# EAGLE design calculator_v0_0 (EAGLE 5.12)

## Sheet 1 of 6
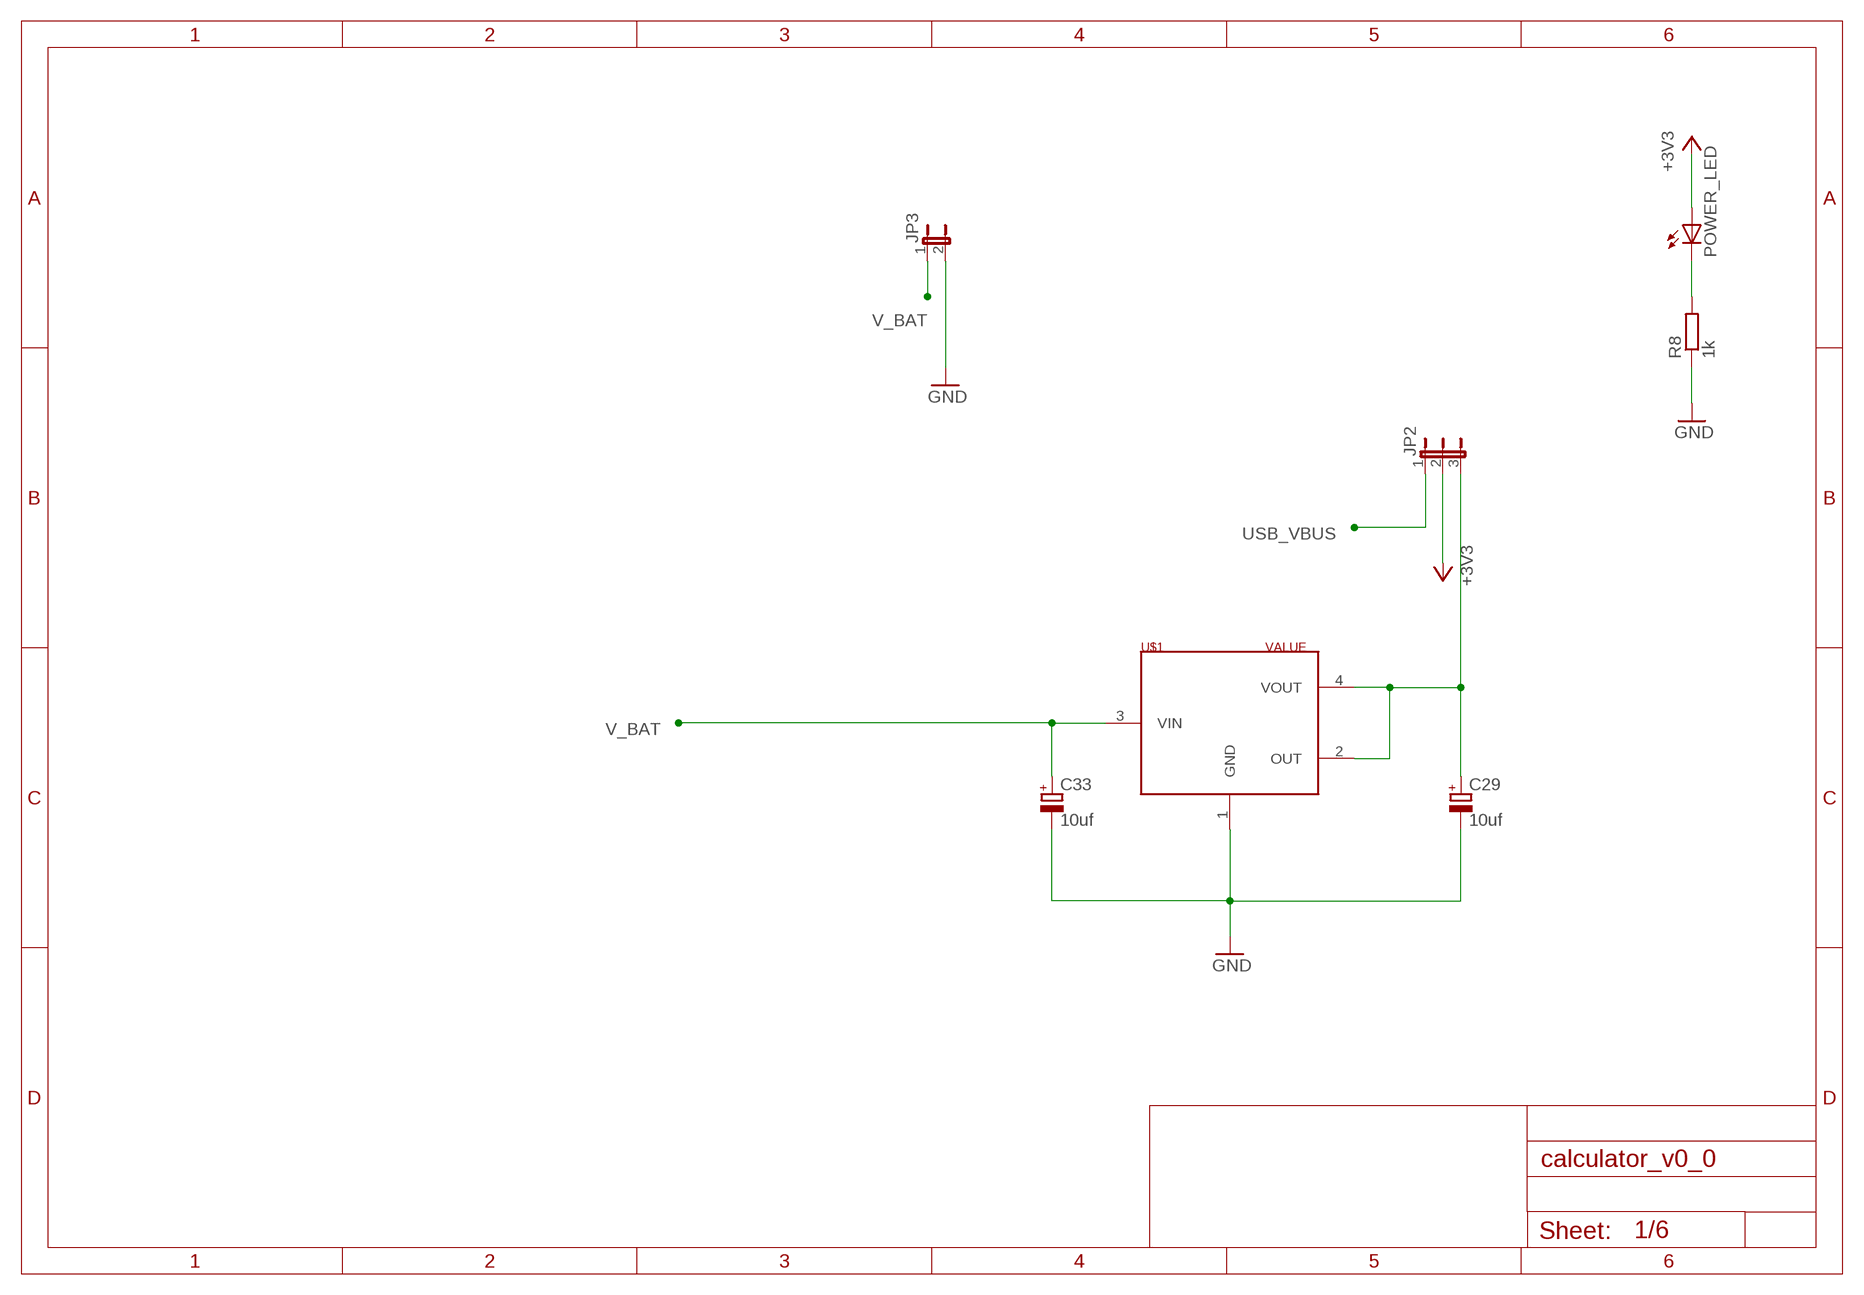
[diagram p0: schematic, sheet 1]

### Parts
C29  10uf  CPOL-EUSMCA  [SMC_A]
C33  10uf  CPOL-EUSMCD  [SMC_D]
JP2  JP2E  [JP2]
JP3  JP1E  [JP1]
POWER_LED  LED3MM  [LED3MM]
R8  1k  R-EU_R0603  [R0603]
U$1  LM1117MPX-5V  [SOT223]

### Nets
+3V3: JP2.2 POWER_LED.A ; also sheet 2,6
GND: C29.- C33.- JP3.2 R8.1 U$1.1(GND) ; also sheet 2,6
N$5: POWER_LED.K(C) R8.2
N$9: C29.+ JP2.3 U$1.2(OUT) U$1.4(VOUT)
USB_VBUS: JP2.1 ; also sheet 2
V_BAT: C33.+ JP3.1 U$1.3(VIN)

## Sheet 2 of 6
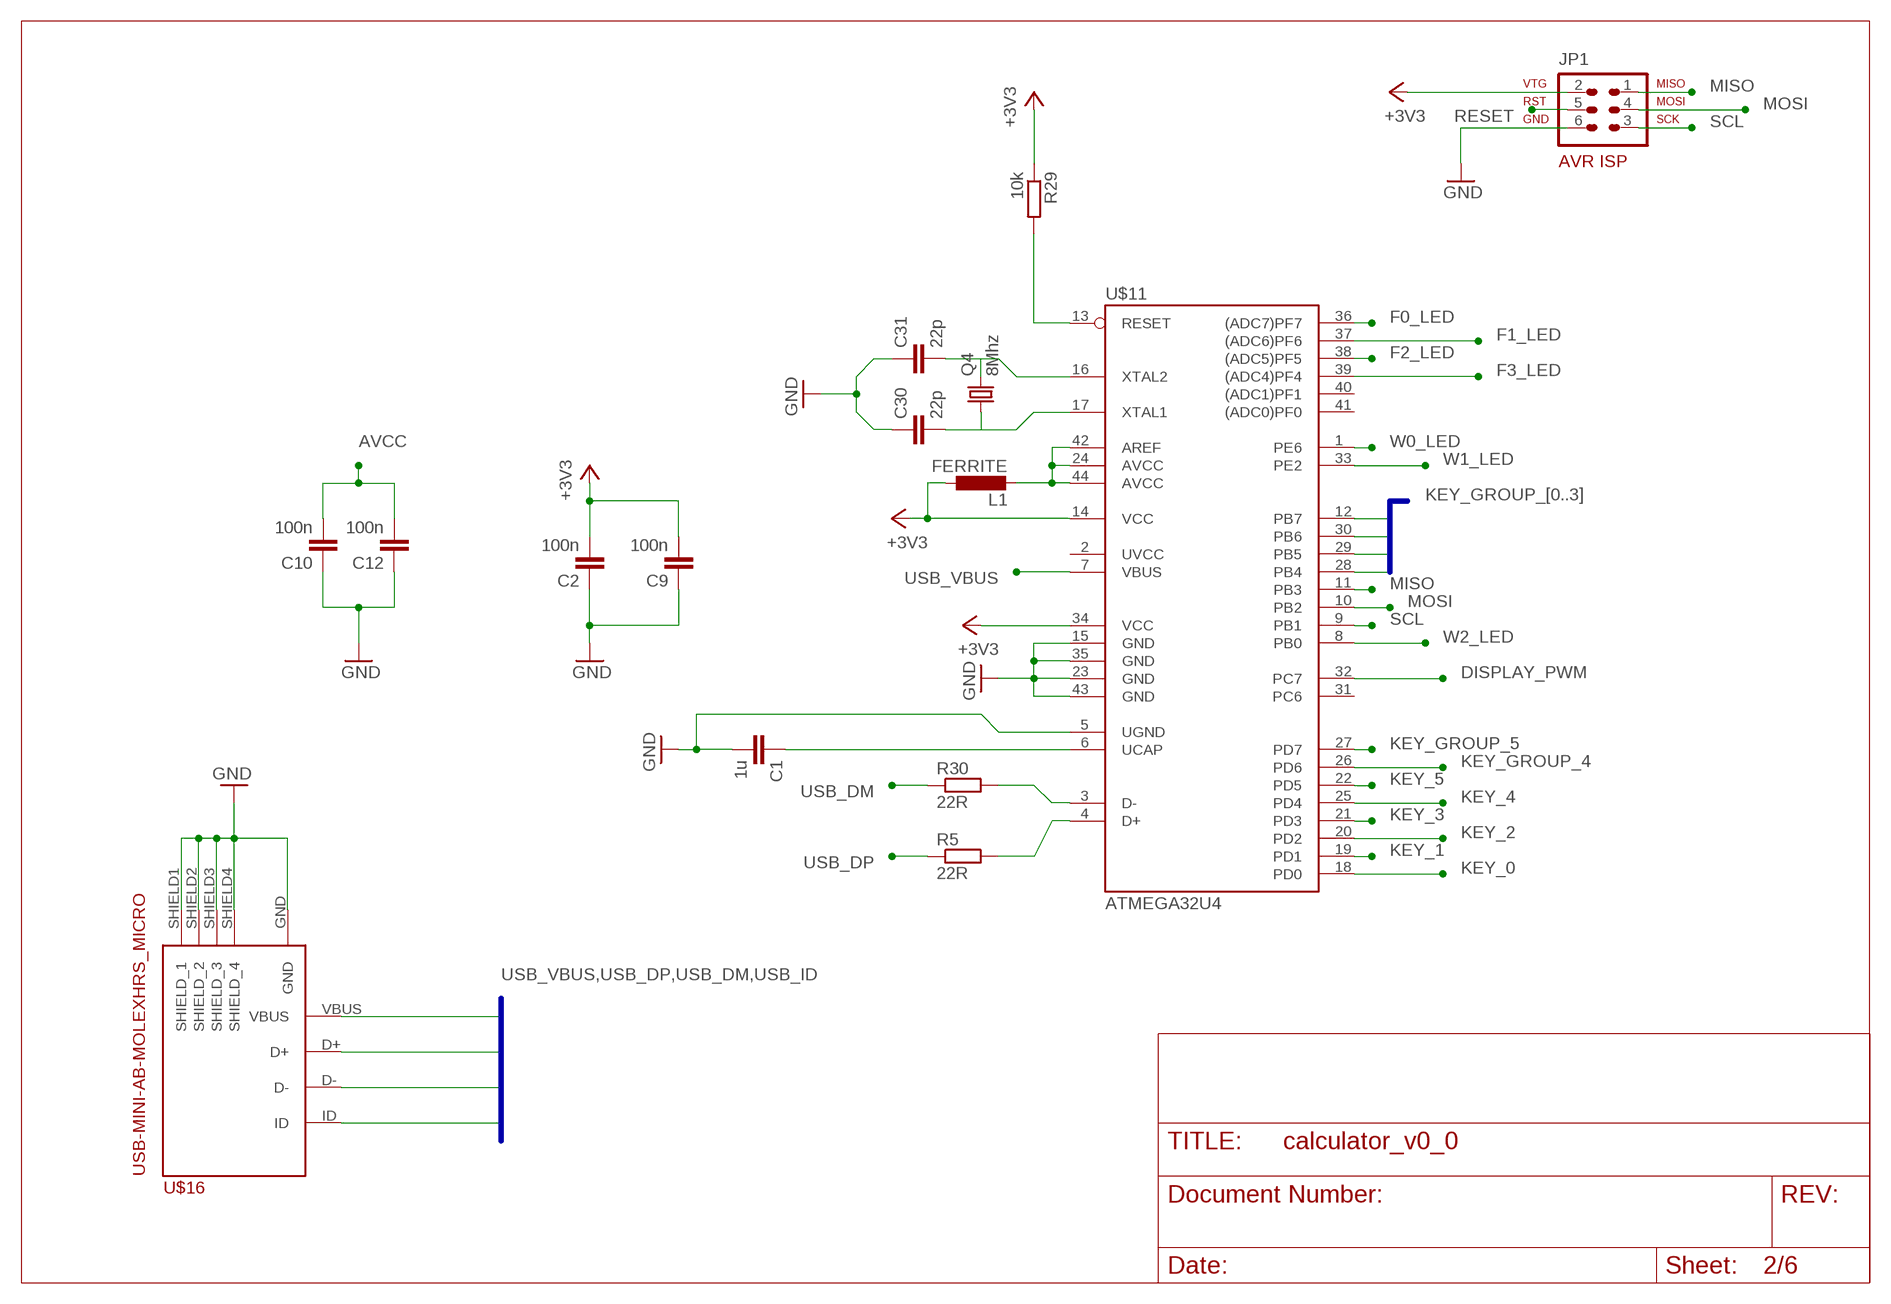
[diagram p1: schematic, sheet 2]

### Parts
C1  1u  C-EUC0603  [C0603]
C2  100n  C-EUC0603  [C0603]
C9  100n  C-EUC0603  [C0603]
C10  100n  C-EUC0603  [C0603]
C12  100n  C-EUC0603  [C0603]
C30  22p  C-EUC0603K  [C0603K]
C31  22p  C-EUC0603K  [C0603K]
JP1  AVR-ISP-6  [AVR-ISP-6]
L1  FERRITE  L-EU603  [R0603]
Q4  8Mhz  CRYSTAL3225  [3225]
R5  22R  R-EU_R0603  [R0603]
R29  10k  R-EU_R0603  [R0603]
R30  22R  R-EU_R0603  [R0603]
U$11  ATMEGA32U4  [TQFP44]
U$16  USB-MINI-AB-MOLEXHRS_MICRO  [ZX62-B-5PA]

### Nets
+3V3: C2.2 C9.2 JP1.2 L1.1 R29.1 U$11.14(VCC) U$11.34(VCC) ; also sheet 1,6
AVCC: C10.2 C12.2 L1.2 U$11.24(AVCC) U$11.42(AREF) U$11.44(AVCC)
DISPLAY_PWM: U$11.32(PC7) ; also sheet 6
F0_LED: U$11.36((ADC7)PF7) ; also sheet 6
F1_LED: U$11.37((ADC6)PF6) ; also sheet 6
F2_LED: U$11.38((ADC5)PF5) ; also sheet 6
F3_LED: U$11.39((ADC4)PF4) ; also sheet 6
GND: C1.2 C2.1 C9.1 C10.1 C12.1 C30.1 C31.1 JP1.6 U$11.5(UGND) U$11.15(GND) U$11.23(GND) U$11.35(GND) U$11.43(GND) U$16.GND U$16.SHIELD1(SHIELD_1) U$16.SHIELD2(SHIELD_2) U$16.SHIELD3(SHIELD_3) U$16.SHIELD4(SHIELD_4) ; also sheet 1,6
KEY_0: U$11.18(PD0) ; also sheet 3
KEY_1: U$11.19(PD1) ; also sheet 3
KEY_2: U$11.20(PD2) ; also sheet 4
KEY_3: U$11.21(PD3) ; also sheet 4
KEY_4: U$11.25(PD4) ; also sheet 5
KEY_5: U$11.22(PD5) ; also sheet 5
KEY_GROUP_0: U$11.28(PB4) ; also sheet 3,4,5
KEY_GROUP_1: U$11.29(PB5) ; also sheet 3,4,5
KEY_GROUP_2: U$11.30(PB6) ; also sheet 3,4,5
KEY_GROUP_3: U$11.12(PB7) ; also sheet 3,4,5
KEY_GROUP_4: U$11.26(PD6) ; also sheet 3,4,5
KEY_GROUP_5: U$11.27(PD7) ; also sheet 3,4,5
MISO: JP1.1 U$11.11(PB3) ; also sheet 6
MOSI: JP1.4 U$11.10(PB2) ; also sheet 6
N$1: C30.2 Q4.1 U$11.17(XTAL1)
N$2: R5.2 U$11.4(D+)
N$3: C1.1 U$11.6(UCAP)
N$20: R30.2 U$11.3(D-)
N$29: C31.2 Q4.3 U$11.16(XTAL2)
RESET: JP1.5 R29.2 U$11.13(RESET)
SCL: JP1.3 U$11.9(PB1) ; also sheet 6
USB_DM: R30.1 U$16.D-
USB_DP: R5.1 U$16.D+
USB_ID: U$16.ID
USB_VBUS: U$11.7(VBUS) U$16.VBUS ; also sheet 1
W0_LED: U$11.1(PE6) ; also sheet 6
W1_LED: U$11.33(PE2) ; also sheet 6
W2_LED: U$11.8(PB0) ; also sheet 6
Unconnected: U$11.31(PC6) U$11.40((ADC1)PF1) U$11.41((ADC0)PF0)

### Buses
USB_VBUS,USB_DP,USB_DM,USB_ID
KEY_GROUP_[0..3]

## Sheet 3 of 6
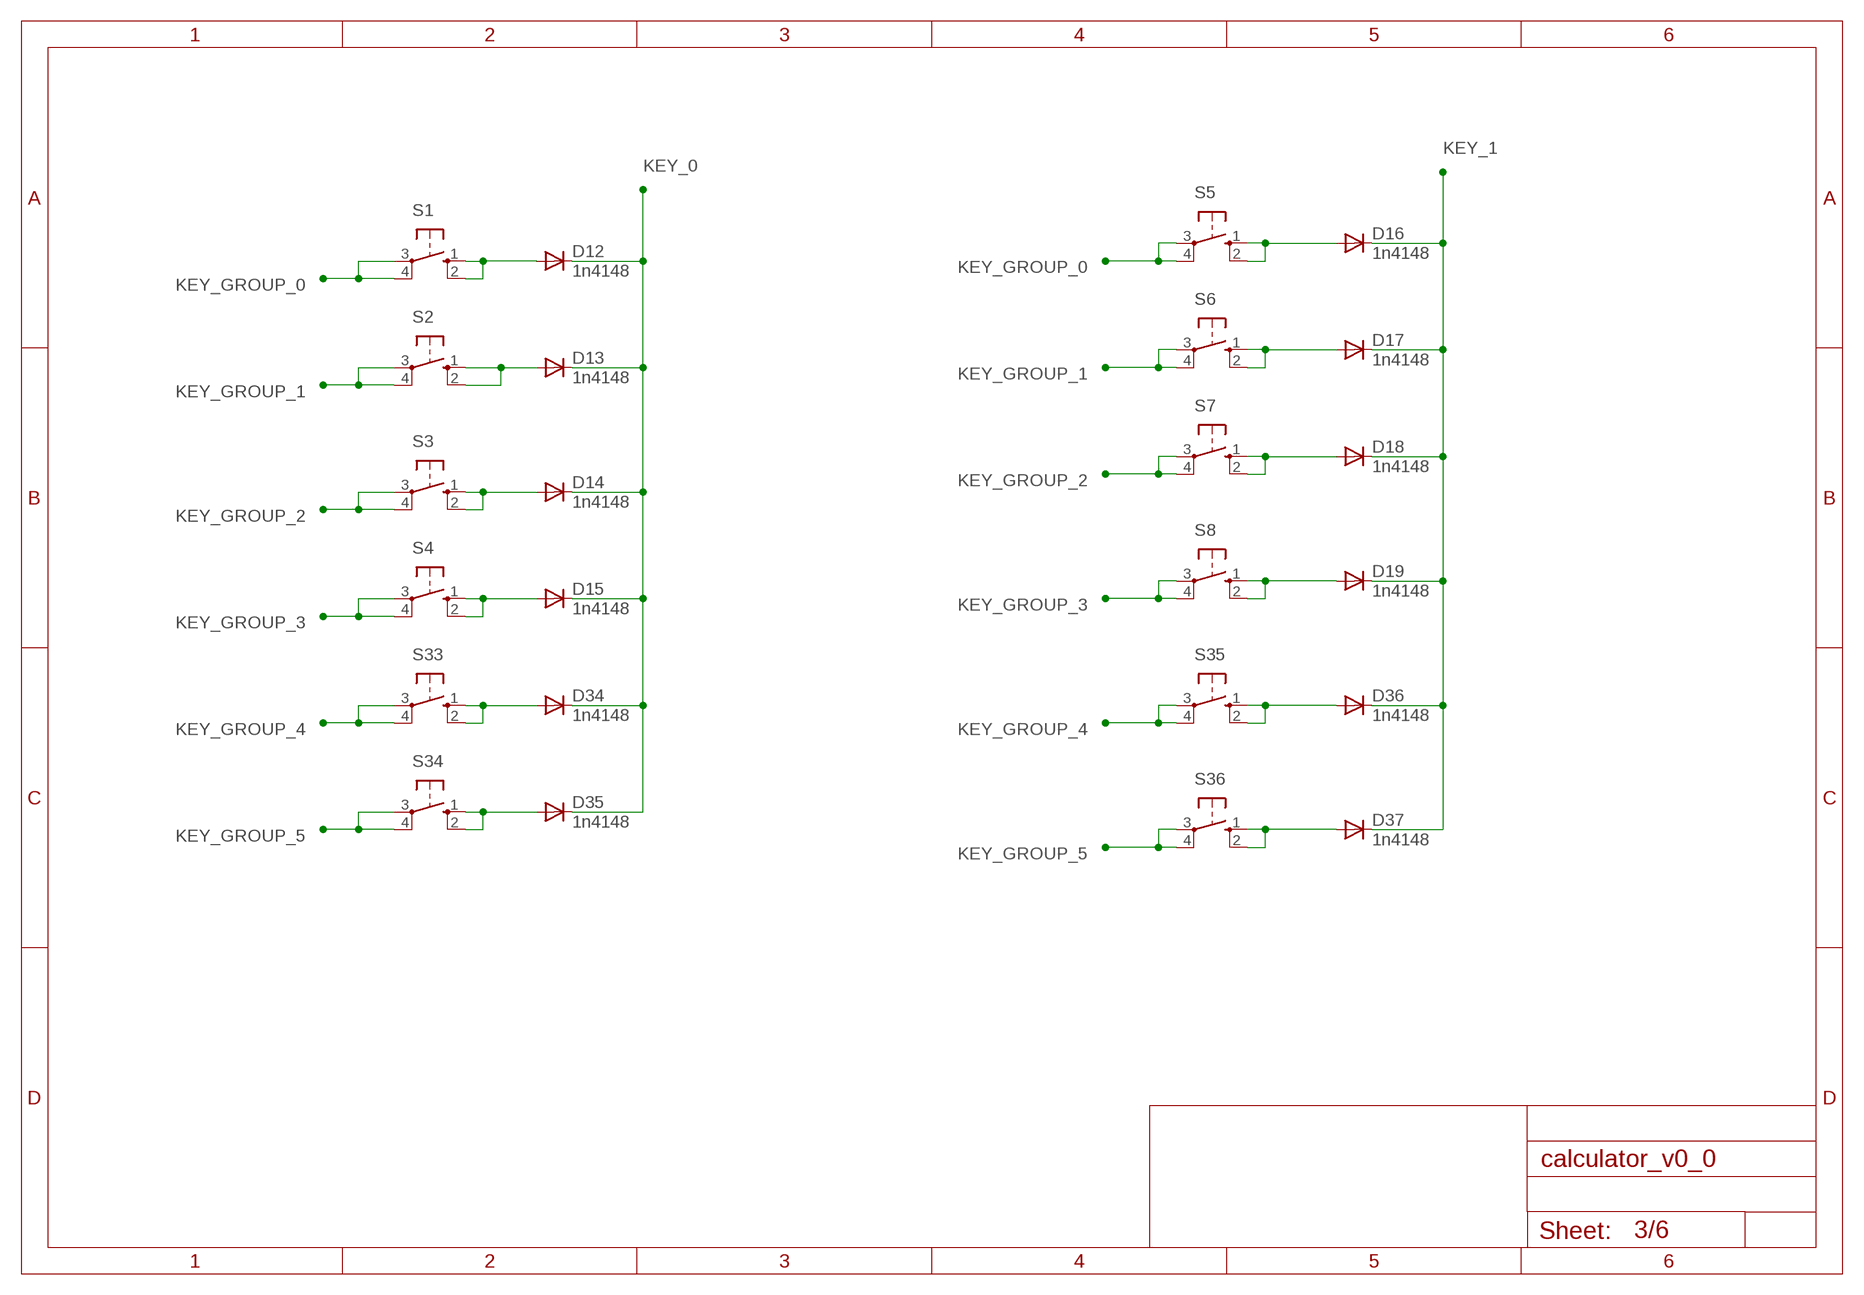
[diagram p2: schematic, sheet 3]

### Parts
D12  1n4148  DIODE-MINIMELF  [MINIMELF]
D13  1n4148  DIODE-MINIMELF  [MINIMELF]
D14  1n4148  DIODE-MINIMELF  [MINIMELF]
D15  1n4148  DIODE-MINIMELF  [MINIMELF]
D16  1n4148  DIODE-MINIMELF  [MINIMELF]
D17  1n4148  DIODE-MINIMELF  [MINIMELF]
D18  1n4148  DIODE-MINIMELF  [MINIMELF]
D19  1n4148  DIODE-MINIMELF  [MINIMELF]
D34  1n4148  DIODE-MINIMELF  [MINIMELF]
D35  1n4148  DIODE-MINIMELF  [MINIMELF]
D36  1n4148  DIODE-MINIMELF  [MINIMELF]
D37  1n4148  DIODE-MINIMELF  [MINIMELF]
S1  40-XX  [B3F-40XX]
S2  40-XX  [B3F-40XX]
S3  40-XX  [B3F-40XX]
S4  40-XX  [B3F-40XX]
S5  40-XX  [B3F-40XX]
S6  40-XX  [B3F-40XX]
S7  40-XX  [B3F-40XX]
S8  40-XX  [B3F-40XX]
S33  40-XX  [B3F-40XX]
S34  40-XX  [B3F-40XX]
S35  40-XX  [B3F-40XX]
S36  40-XX  [B3F-40XX]

### Nets
KEY_0: D12.C D13.C D14.C D15.C D34.C D35.C ; also sheet 2
KEY_1: D16.C D17.C D18.C D19.C D36.C D37.C ; also sheet 2
KEY_GROUP_0: S1.3(P) S1.4(P1) S5.3(P) S5.4(P1) ; also sheet 2,4,5
KEY_GROUP_1: S2.3(P) S2.4(P1) S6.3(P) S6.4(P1) ; also sheet 2,4,5
KEY_GROUP_2: S3.3(P) S3.4(P1) S7.3(P) S7.4(P1) ; also sheet 2,4,5
KEY_GROUP_3: S4.3(P) S4.4(P1) S8.3(P) S8.4(P1) ; also sheet 2,4,5
KEY_GROUP_4: S33.3(P) S33.4(P1) S35.3(P) S35.4(P1) ; also sheet 2,4,5
KEY_GROUP_5: S34.3(P) S34.4(P1) S36.3(P) S36.4(P1) ; also sheet 2,4,5
N$16: D34.A S33.1(S) S33.2(S1)
N$17: D35.A S34.1(S) S34.2(S1)
N$19: D36.A S35.1(S) S35.2(S1)
N$21: D37.A S36.1(S) S36.2(S1)
N$76: D14.A S3.1(S) S3.2(S1)
N$77: D15.A S4.1(S) S4.2(S1)
N$78: D13.A S2.1(S) S2.2(S1)
N$80: D12.A S1.1(S) S1.2(S1)
N$81: D19.A S8.1(S) S8.2(S1)
N$83: D17.A S6.1(S) S6.2(S1)
N$84: D16.A S5.1(S) S5.2(S1)
N$87: D18.A S7.1(S) S7.2(S1)

## Sheet 4 of 6
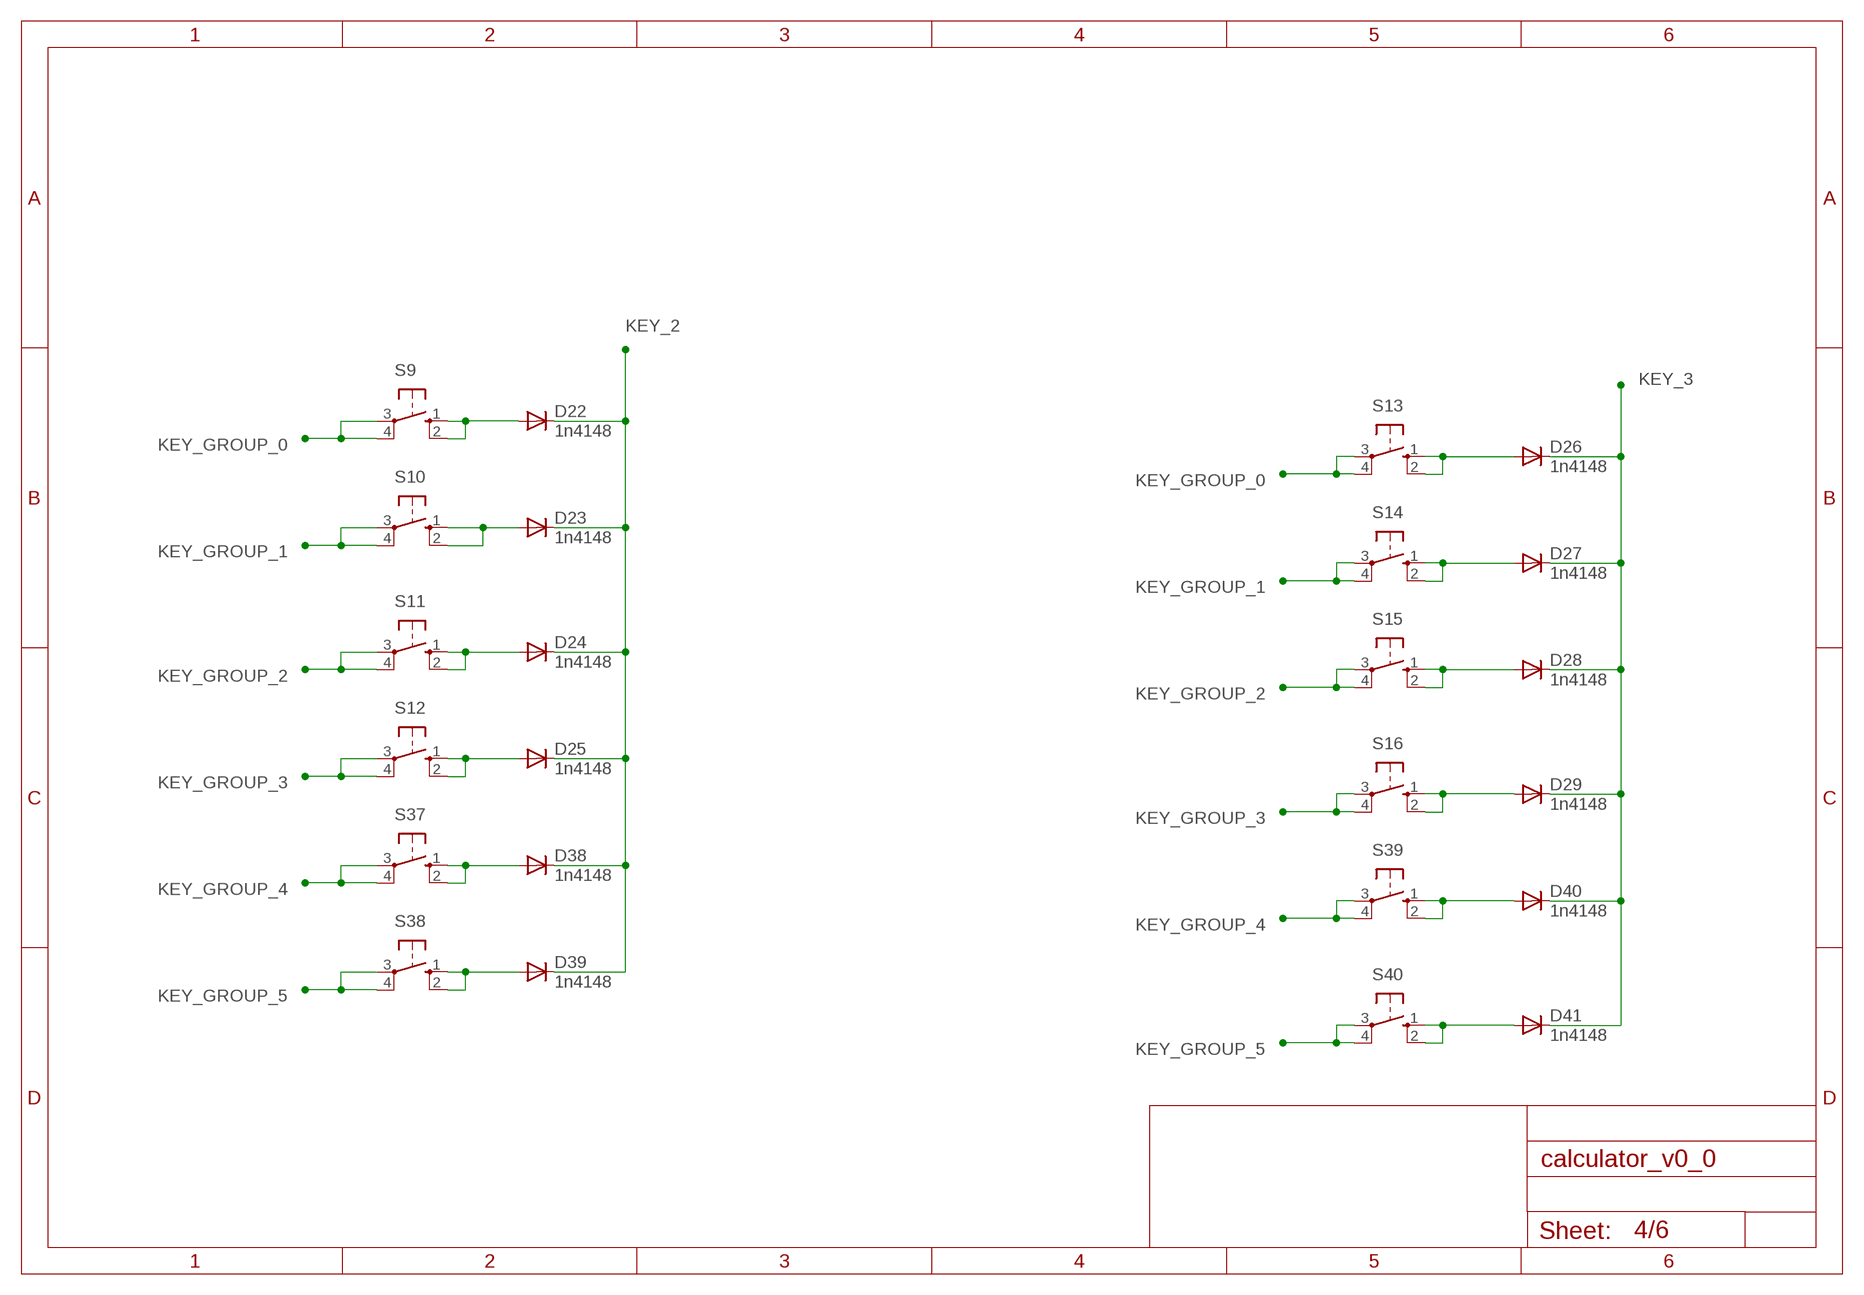
[diagram p3: schematic, sheet 4]

### Parts
D22  1n4148  DIODE-MINIMELF  [MINIMELF]
D23  1n4148  DIODE-MINIMELF  [MINIMELF]
D24  1n4148  DIODE-MINIMELF  [MINIMELF]
D25  1n4148  DIODE-MINIMELF  [MINIMELF]
D26  1n4148  DIODE-MINIMELF  [MINIMELF]
D27  1n4148  DIODE-MINIMELF  [MINIMELF]
D28  1n4148  DIODE-MINIMELF  [MINIMELF]
D29  1n4148  DIODE-MINIMELF  [MINIMELF]
D38  1n4148  DIODE-MINIMELF  [MINIMELF]
D39  1n4148  DIODE-MINIMELF  [MINIMELF]
D40  1n4148  DIODE-MINIMELF  [MINIMELF]
D41  1n4148  DIODE-MINIMELF  [MINIMELF]
S9  40-XX  [B3F-40XX]
S10  40-XX  [B3F-40XX]
S11  40-XX  [B3F-40XX]
S12  40-XX  [B3F-40XX]
S13  40-XX  [B3F-40XX]
S14  40-XX  [B3F-40XX]
S15  40-XX  [B3F-40XX]
S16  40-XX  [B3F-40XX]
S37  40-XX  [B3F-40XX]
S38  40-XX  [B3F-40XX]
S39  40-XX  [B3F-40XX]
S40  40-XX  [B3F-40XX]

### Nets
KEY_2: D22.C D23.C D24.C D25.C D38.C D39.C ; also sheet 2
KEY_3: D26.C D27.C D28.C D29.C D40.C D41.C ; also sheet 2
KEY_GROUP_0: S9.3(P) S9.4(P1) S13.3(P) S13.4(P1) ; also sheet 2,3,5
KEY_GROUP_1: S10.3(P) S10.4(P1) S14.3(P) S14.4(P1) ; also sheet 2,3,5
KEY_GROUP_2: S11.3(P) S11.4(P1) S15.3(P) S15.4(P1) ; also sheet 2,3,5
KEY_GROUP_3: S12.3(P) S12.4(P1) S16.3(P) S16.4(P1) ; also sheet 2,3,5
KEY_GROUP_4: S37.3(P) S37.4(P1) S39.3(P) S39.4(P1) ; also sheet 2,3,5
KEY_GROUP_5: S38.3(P) S38.4(P1) S40.3(P) S40.4(P1) ; also sheet 2,3,5
N$27: D38.A S37.1(S) S37.2(S1)
N$28: D39.A S38.1(S) S38.2(S1)
N$39: D40.A S39.1(S) S39.2(S1)
N$41: D41.A S40.1(S) S40.2(S1)
N$93: D24.A S11.1(S) S11.2(S1)
N$95: D25.A S12.1(S) S12.2(S1)
N$96: D23.A S10.1(S) S10.2(S1)
N$97: D22.A S9.1(S) S9.2(S1)
N$99: D29.A S16.1(S) S16.2(S1)
N$101: D28.A S15.1(S) S15.2(S1)
N$102: D27.A S14.1(S) S14.2(S1)
N$104: D26.A S13.1(S) S13.2(S1)

## Sheet 5 of 6
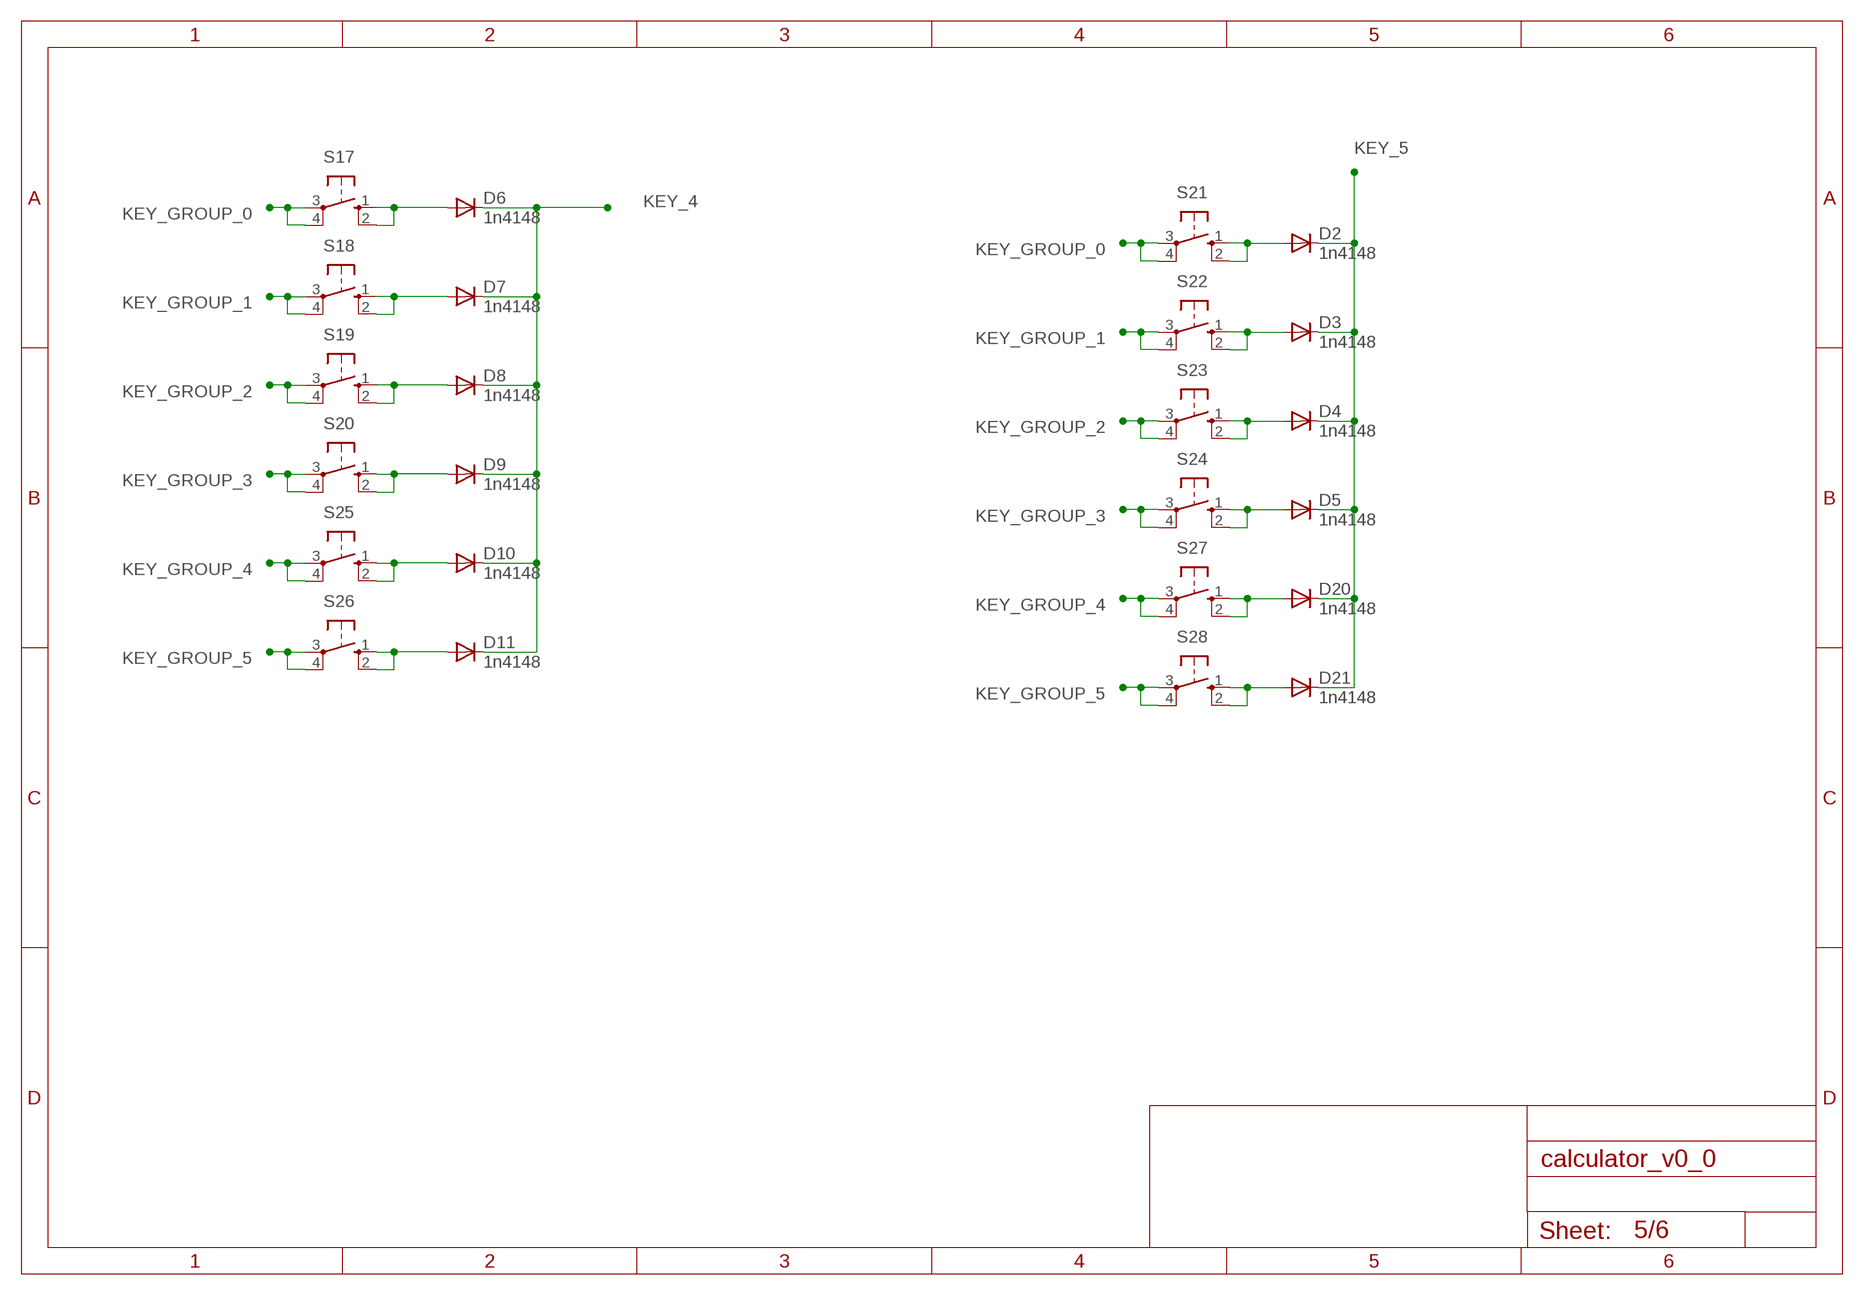
[diagram p4: schematic, sheet 5]

### Parts
D2  1n4148  DIODE-MINIMELF  [MINIMELF]
D3  1n4148  DIODE-MINIMELF  [MINIMELF]
D4  1n4148  DIODE-MINIMELF  [MINIMELF]
D5  1n4148  DIODE-MINIMELF  [MINIMELF]
D6  1n4148  DIODE-MINIMELF  [MINIMELF]
D7  1n4148  DIODE-MINIMELF  [MINIMELF]
D8  1n4148  DIODE-MINIMELF  [MINIMELF]
D9  1n4148  DIODE-MINIMELF  [MINIMELF]
D10  1n4148  DIODE-MINIMELF  [MINIMELF]
D11  1n4148  DIODE-MINIMELF  [MINIMELF]
D20  1n4148  DIODE-MINIMELF  [MINIMELF]
D21  1n4148  DIODE-MINIMELF  [MINIMELF]
S17  40-XX  [B3F-40XX]
S18  40-XX  [B3F-40XX]
S19  40-XX  [B3F-40XX]
S20  40-XX  [B3F-40XX]
S21  40-XX  [B3F-40XX]
S22  40-XX  [B3F-40XX]
S23  40-XX  [B3F-40XX]
S24  40-XX  [B3F-40XX]
S25  40-XX  [B3F-40XX]
S26  40-XX  [B3F-40XX]
S27  40-XX  [B3F-40XX]
S28  40-XX  [B3F-40XX]

### Nets
KEY_4: D6.C D7.C D8.C D9.C D10.C D11.C ; also sheet 2
KEY_5: D2.C D3.C D4.C D5.C D20.C D21.C ; also sheet 2
KEY_GROUP_0: S17.3(P) S17.4(P1) S21.3(P) S21.4(P1) ; also sheet 2,3,4
KEY_GROUP_1: S18.3(P) S18.4(P1) S22.3(P) S22.4(P1) ; also sheet 2,3,4
KEY_GROUP_2: S19.3(P) S19.4(P1) S23.3(P) S23.4(P1) ; also sheet 2,3,4
KEY_GROUP_3: S20.3(P) S20.4(P1) S24.3(P) S24.4(P1) ; also sheet 2,3,4
KEY_GROUP_4: S25.3(P) S25.4(P1) S27.3(P) S27.4(P1) ; also sheet 2,3,4
KEY_GROUP_5: S26.3(P) S26.4(P1) S28.3(P) S28.4(P1) ; also sheet 2,3,4
N$4: D10.A S25.1(S) S25.2(S1)
N$6: D11.A S26.1(S) S26.2(S1)
N$7: D20.A S27.1(S) S27.2(S1)
N$8: D3.A S22.1(S) S22.2(S1)
N$10: D2.A S21.1(S) S21.2(S1)
N$11: D21.A S28.1(S) S28.2(S1)
N$18: D4.A S23.1(S) S23.2(S1)
N$22: D5.A S24.1(S) S24.2(S1)
N$70: D7.A S18.1(S) S18.2(S1)
N$71: D6.A S17.1(S) S17.2(S1)
N$72: D8.A S19.1(S) S19.2(S1)
N$73: D9.A S20.1(S) S20.2(S1)

## Sheet 6 of 6
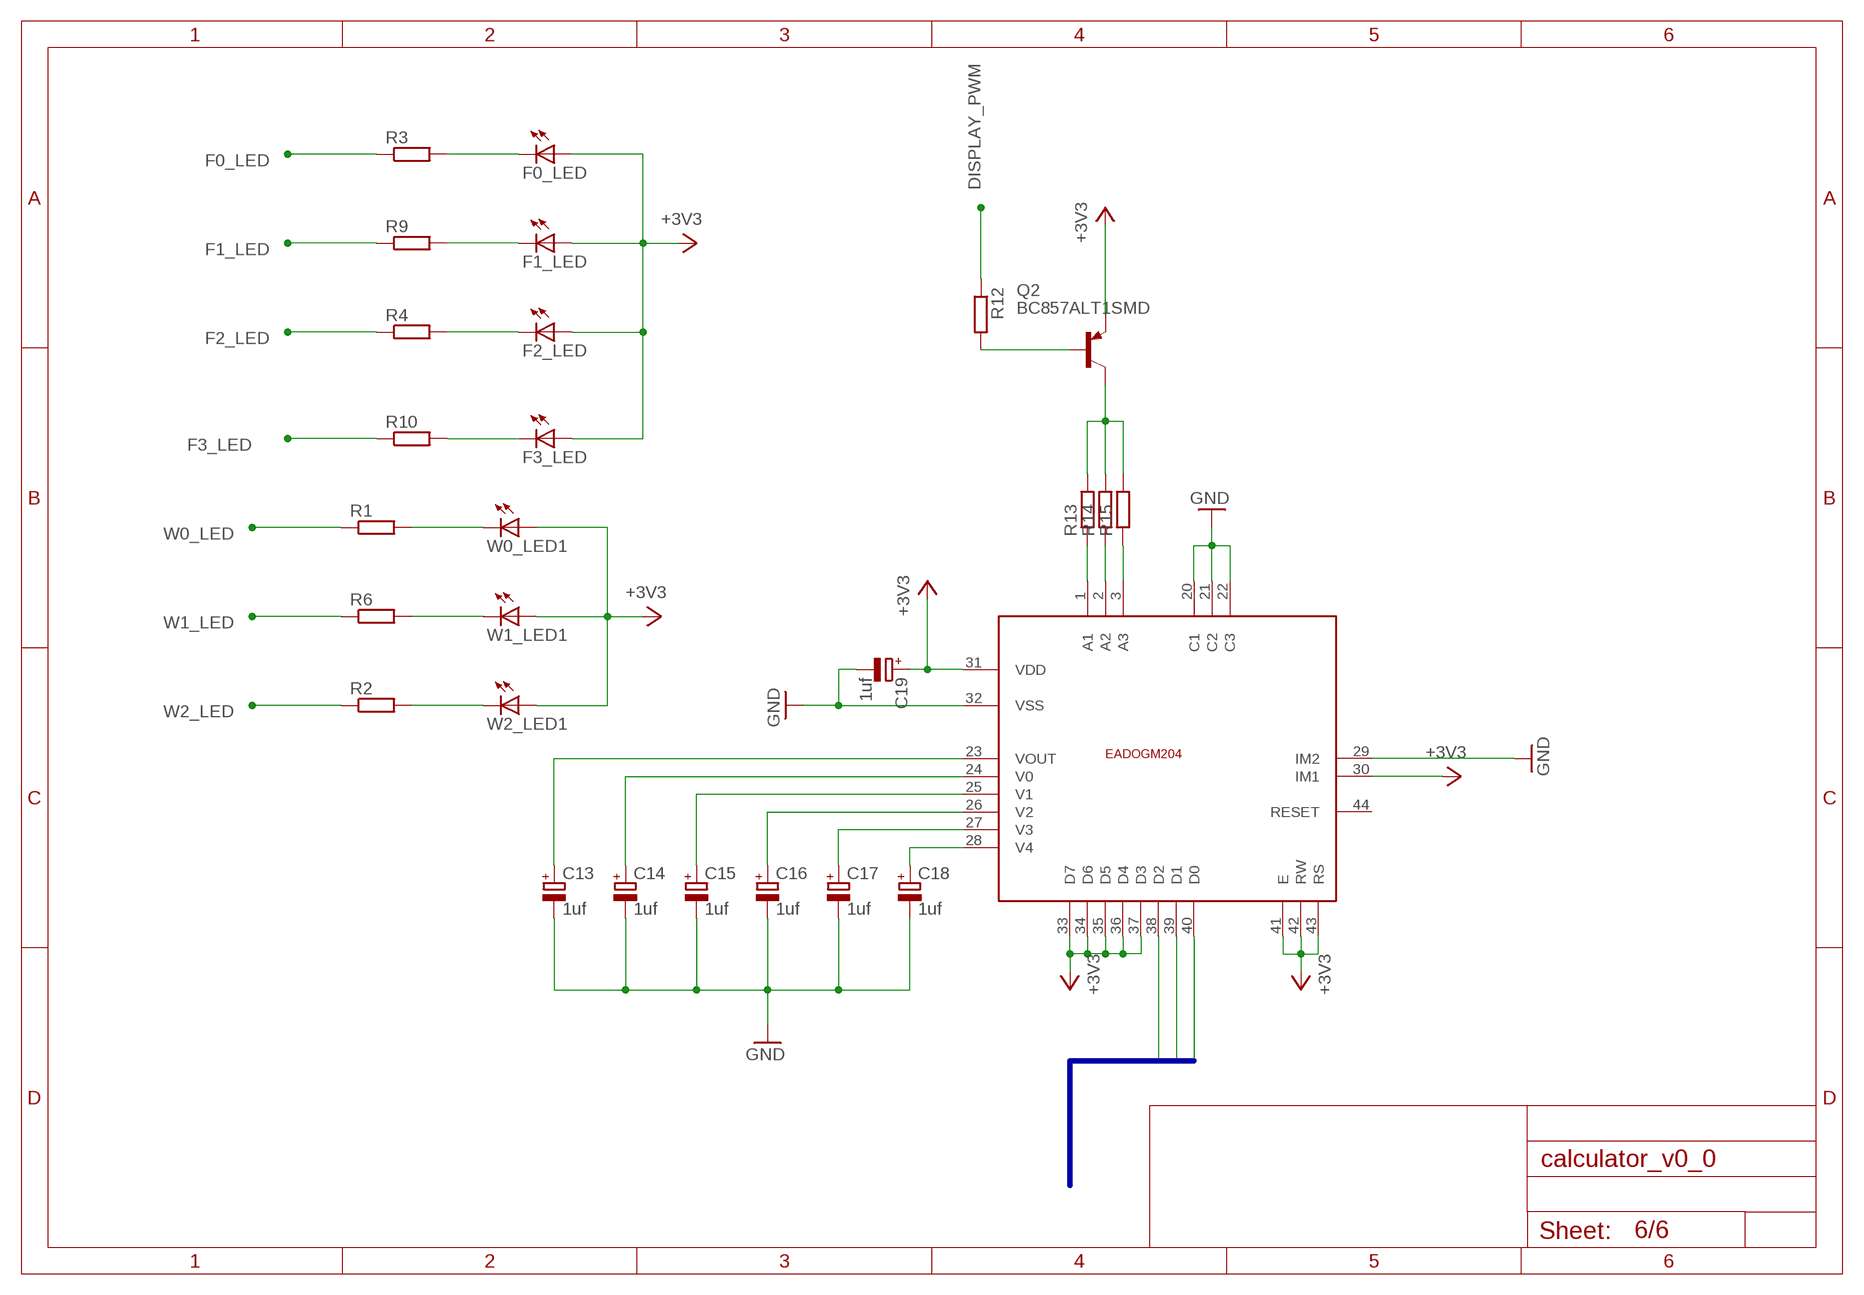
[diagram p5: schematic, sheet 6]

### Parts
C13  1uf  CPOL-EUSMCA  [SMC_A]
C14  1uf  CPOL-EUSMCA  [SMC_A]
C15  1uf  CPOL-EUSMCA  [SMC_A]
C16  1uf  CPOL-EUSMCA  [SMC_A]
C17  1uf  CPOL-EUSMCA  [SMC_A]
C18  1uf  CPOL-EUSMCA  [SMC_A]
C19  1uf  CPOL-EUSMCA  [SMC_A]
F0_LED  LED3MM  [LED3MM]
F1_LED  LED3MM  [LED3MM]
F2_LED  LED3MM  [LED3MM]
F3_LED  LED3MM  [LED3MM]
Q2  BC857ALT1SMD  [SOT23-BEC]
R1  R-EU_R0603  [R0603]
R2  R-EU_R0603  [R0603]
R3  R-EU_R0603  [R0603]
R4  R-EU_R0603  [R0603]
R6  R-EU_R0603  [R0603]
R9  R-EU_R0603  [R0603]
R10  R-EU_R0603  [R0603]
R12  R-EU_R0603  [R0603]
R13  R-EU_R0603  [R0603]
R14  R-EU_R0603  [R0603]
R15  R-EU_R0603  [R0603]
U$4  EADOGM204  [EADOGM204]
W0_LED1  LED3MM  [LED3MM]
W1_LED1  LED3MM  [LED3MM]
W2_LED1  LED3MM  [LED3MM]

### Nets
+3V3: C19.+ F0_LED.A F1_LED.A F2_LED.A F3_LED.A Q2.E U$4.30(IM1) U$4.31(VDD) U$4.33(D7) U$4.34(D6) U$4.35(D5) U$4.36(D4) U$4.37(D3) U$4.41(E) U$4.42(RW) U$4.43(RS) W0_LED1.A W1_LED1.A W2_LED1.A ; also sheet 1,2
DISPLAY_PWM: R12.1 ; also sheet 2
F0_LED: R3.1 ; also sheet 2
F1_LED: R9.1 ; also sheet 2
F2_LED: R4.1 ; also sheet 2
F3_LED: R10.1 ; also sheet 2
GND: C13.- C14.- C15.- C16.- C17.- C18.- C19.- U$4.20(C1) U$4.21(C2) U$4.22(C3) U$4.29(IM2) U$4.32(VSS) ; also sheet 1,2
MISO: U$4.38(D2) ; also sheet 2
MOSI: U$4.39(D1) ; also sheet 2
N$12: R1.2 W0_LED1.K(C)
N$13: R6.2 W1_LED1.K(C)
N$14: R2.2 W2_LED1.K(C)
N$23: F0_LED.K(C) R3.2
N$25: F1_LED.K(C) R9.2
N$26: F2_LED.K(C) R4.2
N$30: F3_LED.K(C) R10.2
N$31: Q2.B R12.2
N$32: R15.1 U$4.3(A3)
N$33: R14.1 U$4.2(A2)
N$34: C13.+ U$4.23(VOUT)
N$35: R13.1 U$4.1(A1)
N$36: C14.+ U$4.24(V0)
N$37: Q2.C R13.2 R14.2 R15.2
N$38: C15.+ U$4.25(V1)
N$40: C16.+ U$4.26(V2)
N$45: C17.+ U$4.27(V3)
N$58: C18.+ U$4.28(V4)
SCL: U$4.40(D0) ; also sheet 2
W0_LED: R1.1 ; also sheet 2
W1_LED: R6.1 ; also sheet 2
W2_LED: R2.1 ; also sheet 2
Unconnected: U$4.44(RESET)

### Buses
MOSI,MISO,SCL

## Power pins joined to a net without a drawn wire
UVCC: U$11.2(UVCC)

## Library data of the parts
C1 C2 C9 C10 C12 C30 C31 = rcl:C-EU: CAPACITOR, European symbol
C13-C19 C29 C33 = rcl:CPOL-EU: POLARIZED CAPACITOR, European symbol
D2-D29 D34-D41 = diode:DIODE-: DIODE
F0_LED F1_LED F2_LED F3_LED POWER_LED W0_LED1 W1_LED1 W2_LED1 = led:LED: LED OSRAM: - CHIPLED LG R971, LG N971, LY N971, LG Q971, LY Q971, LO R971, LY R971 LH N974, LH R974 LS Q976, LO Q976, LY Q976 LO Q996 - Hyper CHIPLED LW Q18S LB Q993, LB Q99A, LB R99A - SideLED LS A670, LO A670, LY A670, LG A670, LP A670 LB A673, LV A673, LT A673, LW A673 LH A674 LY A675 LS A676, LA A676, LO A676, LY A676, LW A676 LS A679, LY A679, LG A679 - Hyper Micro SIDELED® LS Y876, LA Y876, LO Y876, LY Y876 LT Y87S - SmartLED LW L88C, LW L88S LB L89C, LB L89S, LG L890 LS L89K, LO L89K, LY L89K LS L896, LA L896, LO L896, LY L896 - TOPLED LS T670, LO T670, LY T670, LG T670, LP T670 LSG T670, LSP T670, LSY T670, LOP T670, LYG T670 LG T671, LOG T671, LSG T671 LB T673, LV T673, LT T673, LW T673 LH T674 LS T676, LA T676, LO T676, LY T676, LB T676, LH T676, LSB T676, LW T676 LB T67C, LV T67C, LT T67C, LS T67K, LO T67K, LY T67K, LW E67C LS E67B, LA E67B, LO E67B, LY E67B, LB E67C, LV E67C, LT E67C LW T67C LS T679, LY T679, LG T679 LS T770, LO T770, LY T770, LG T770, LP T770 LB T773, LV T773, LT T773, LW T773 LH T774 LS E675, LA E675, LY E675, LS T675 LS T776, LA T776, LO T776, LY T776, LB T776 LHGB T686 LT T68C, LB T68C - Hyper Mini TOPLED® LB M676 - Mini TOPLED Santana® LG M470 LS M47K, LO M47K, LY M47K Source: http://www.osram.convergy.de LUXEON: - LUMILED® LXK2-PW12-R00, LXK2-PW12-S00, LXK2-PW14-U00, LXK2-PW14-V00 LXK2-PM12-R00, LXK2-PM12-S00, LXK2-PM14-U00 LXK2-PE12-Q00, LXK2-PE12-R00, LXK2-PE12-S00, LXK2-PE14-T00, LXK2-PE14-U00 LXK2-PB12-K00, LXK2-PB12-L00, LXK2-PB12-M00, LXK2-PB14-N00, LXK2-PB14-P00, LXK2-PB14-Q00 LXK2-PR12-L00, LXK2-PR12-M00, LXK2-PR14-Q00, LXK2-PR14-R00 LXK2-PD12-Q00, LXK2-PD12-R00, LXK2-PD12-S00 LXK2-PH12-R00, LXK2-PH12-S00 LXK2-PL12-P00, LXK2-PL12-Q00, LXK2-PL12-R00 Source: www.luxeon.com KINGBRIGHT: KA-3528ASYC Source: www.kingbright.com
JP1 = atmel-1:AVR-ISP-6: AVR ISP-6 Serial Programming Header
JP2 = jumper:JP2E: JUMPER
JP3 = jumper:JP1E: JUMPER
L1 = lat_rcl:L-EU: INDUCTOR, European symbol
Q2 = transistor-pnp:BC857*: PNP Transistror
Q4 = LAT-Crystal:CRYSTAL: CRYSTAL
R1-R6 R8-R10 R12-R15 R29 R30 = rcl:R-EU_: RESISTOR, European symbol
S1-S28 S33-S40 = LAT-switches:40-XX: OMRON SWITCH
U$1 = LAT-POWER:LM1117MPX-5V
U$4 = ea-dogm:EADOGM204
U$11 = LAT-AVR-8:ATMEGA32U4
U$16 = LAT-USB:USB-MINI-AB-MOLEX

## Board
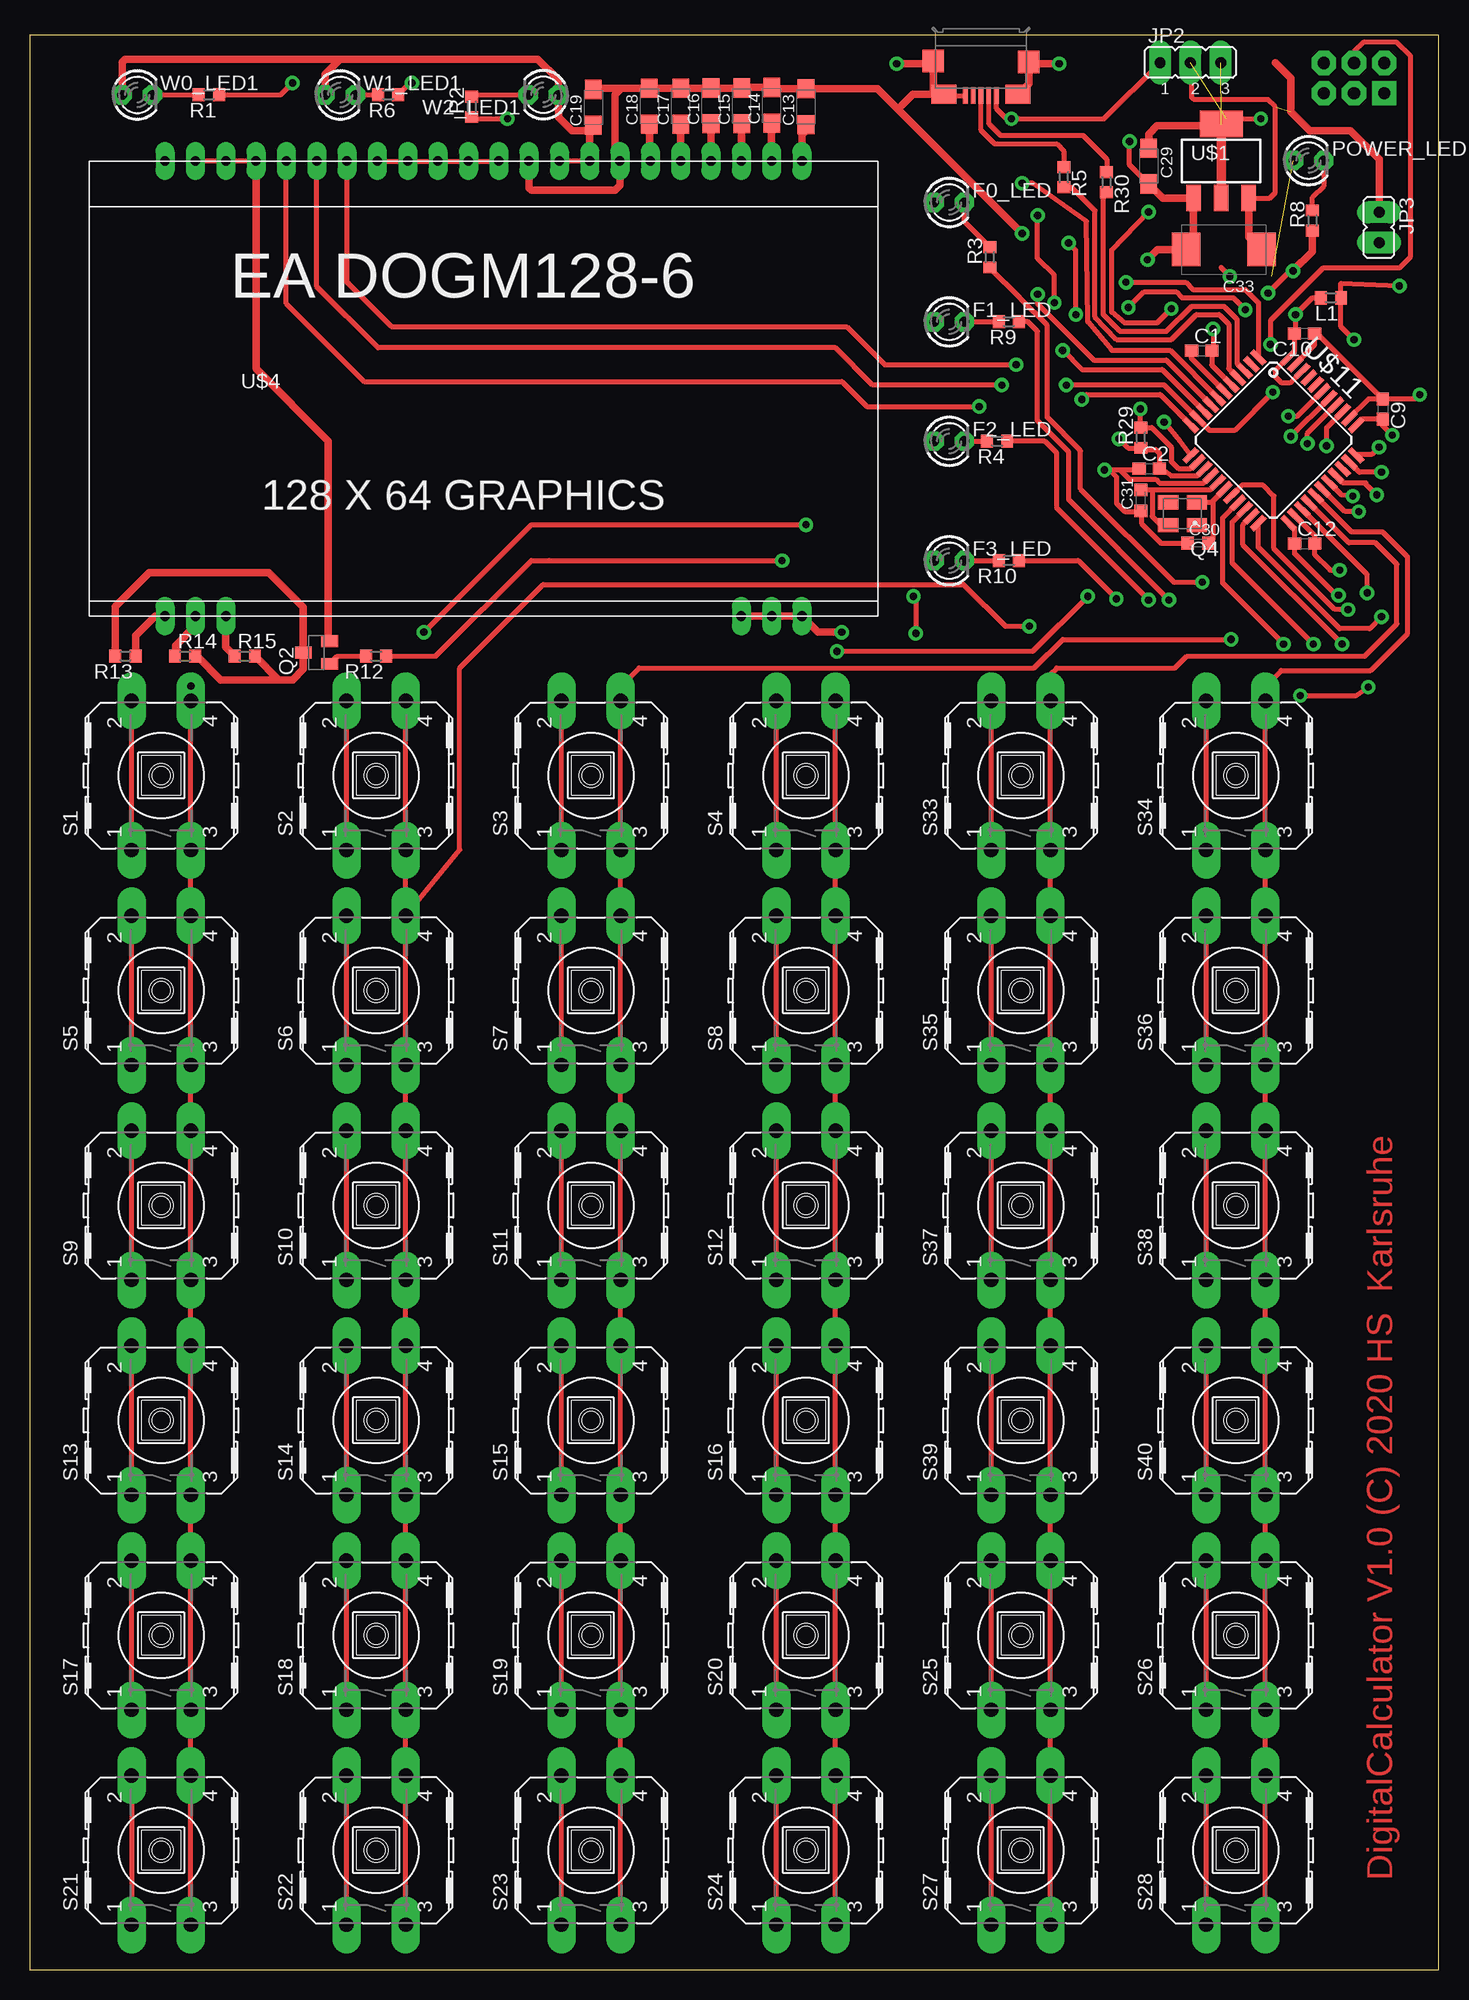
[diagram p6: board, top side]
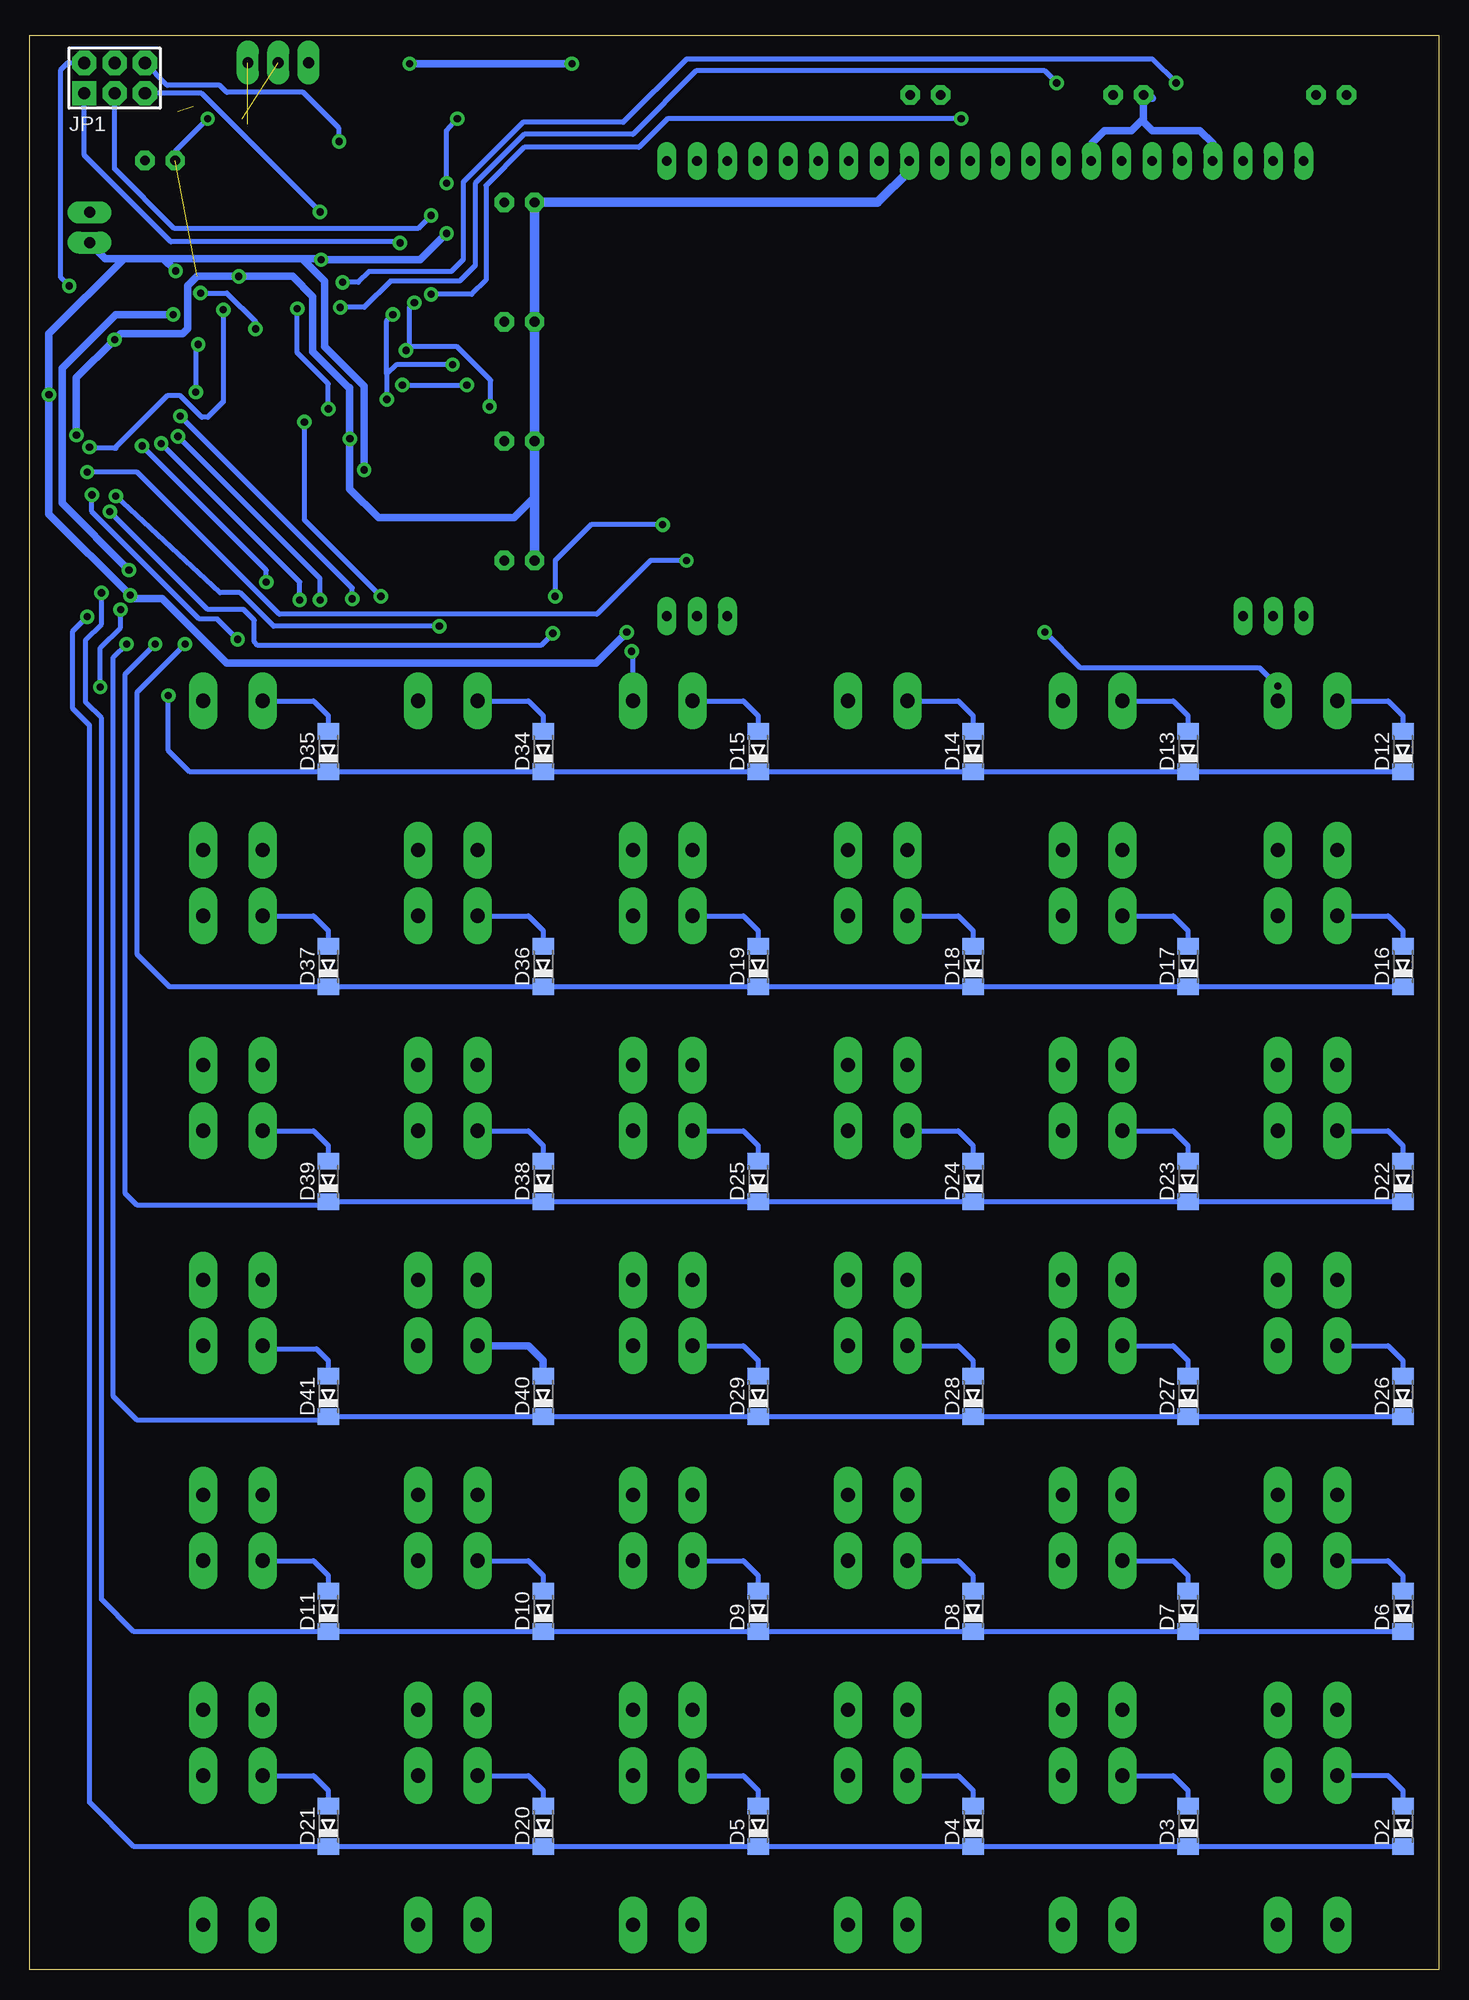
[diagram p7: board, bottom side, seen from below]

Size 118 x 162 mm. Coordinates in mm from the lower left corner, seen from the top.
Outline: 0,0 118,0 118,162 0,162 0,0
Copper layers (1*16): Top 0.035mm / dielectric 1.5mm / Bottom 0.035mm
Design rules "PCB-POOL HighSpec": minimum track width 0.125mm, minimum drill 0.2mm, track to track 0.125mm, track to pad 0.125mm, pad to pad 0.125mm, via to via 0.125mm, smd to smd 0.125mm, copper to edge 0.3mm, drill to drill 0.2mm, minimum pad ring 0.2mm, minimum via ring 0.125mm, stop-mask expansion 0.075mm, vias tented up to drill 0mil, thermal gap 0.2mm

### Footprints (pad centres in the part's own frame; a part is rotated, then mirrored left to right if it is on the bottom)
C0603 = smd 1.1 x 1: 1 -0.85,0; 2 0.85,0
SMC_A = smd 1.6 x 1.4: + -1.5,0; - 1.5,0
C0603K = smd 1.05 x 1.08: 1 -0.875,0; 2 0.875,0
SMC_D = smd 2.4 x 2.8: + -3.15,0; - 3.15,0
MINIMELF = smd 1.4 x 1.8: A 1.7,0; C -1.7,0
LED3MM = drill 0.813 octagon: A -1.27,0; K 1.27,0
AVR-ISP-6 = drill 1.016 square: 1 -2.54,-1.27 | drill 1.016 octagon: 2 -2.54,1.27; 3 0,-1.27; 4 0,1.27; 5 2.54,-1.27; 6 2.54,1.27
JP2 = drill 0.914 long: 1 -2.54,0; 2 0,0; 3 2.54,0
JP1 = drill 0.914 long: 1 0,-1.27; 2 0,1.27
R0603 = smd 1 x 1.1: 1 -0.85,0; 2 0.85,0
SOT23-BEC = smd 1 x 1.4: B -0.95,-1.1; C 0,1.1; E 0.95,-1.1
3225 = smd 1.7 x 1.2: 1 0.4,0.3; 2 2.8,0.3; 3 2.8,2.2; 4 0.4,2.2
B3F-40XX = drill 1.194 long: 1 -6.248,2.489; 2 6.248,2.489; 3 -6.248,-2.489; 4 6.248,-2.489
SOT223 = smd 1.219 x 2.235: 1 -2.311,-3.099; 2 0,-3.099; 3 2.311,-3.099 | smd 3.6 x 2.2: 4 0,3.099
EADOGM204 = drill 0.8 long: 1 6.35,0; 2 8.89,0; 3 11.43,0; 20 54.61,0; 21 57.15,0; 22 59.69,0; 23 59.69,38.1; 24 57.15,38.1; 25 54.61,38.1; 26 52.07,38.1; 27 49.53,38.1; 28 46.99,38.1; 29 44.45,38.1; 30 41.91,38.1; 31 39.37,38.1; 32 36.83,38.1; 33 34.29,38.1; 34 31.75,38.1; 35 29.21,38.1; 36 26.67,38.1; 37 24.13,38.1; 38 21.59,38.1; 39 19.05,38.1; 40 16.51,38.1; 41 13.97,38.1; 42 11.43,38.1; 43 8.89,38.1; 44 6.35,38.1
TQFP44 = smd 1.5 x 0.5: 1 -5.8,4; 2 -5.8,3.2; 3 -5.8,2.4; 4 -5.8,1.6; 5 -5.8,0.8; 6 -5.8,0; 7 -5.8,-0.8; 8 -5.8,-1.6; 9 -5.8,-2.4; 10 -5.8,-3.2; 11 -5.8,-4; 23 5.8,-4; 24 5.8,-3.2; 25 5.8,-2.4; 26 5.8,-1.6; 27 5.8,-0.8; 28 5.8,0; 29 5.8,0.8; 30 5.8,1.6; 31 5.8,2.4; 32 5.8,3.2; 33 5.8,4 | smd 0.5 x 1.5: 12 -4,-5.8; 13 -3.2,-5.8; 14 -2.4,-5.8; 15 -1.6,-5.8; 16 -0.8,-5.8; 17 0,-5.8; 18 0.8,-5.8; 19 1.6,-5.8; 20 2.4,-5.8; 21 3.2,-5.8; 22 4,-5.8; 34 4,5.8; 35 3.2,5.8; 36 2.4,5.8; 37 1.6,5.8; 38 0.8,5.8; 39 0,5.8; 40 -0.8,5.8; 41 -1.6,5.8; 42 -2.4,5.8; 43 -3.2,5.8; 44 -4,5.8
ZX62-B-5PA = smd 0.4 x 1.35: D+ 0,2.8; D- -0.65,2.8; GND 1.3,2.8; ID 0.65,2.8; VBUS -1.3,2.8 | smd 1.8 x 1.9: SHIELD1 -4,0; SHIELD4 4,-0.1 | smd 2.1 x 1.6: SHIELD2 -3.1,2.7; SHIELD3 3.1,2.7

### Placement (x,y rotation side)
C1  98.14,135.56 0 top
C2  93.76,125.71 0 top
C9  113.31,130.68 270 top
C10  106.74,137.01 180 top
C12  106.77,119.41 0 top
C13  65,156 90 top
C14  62.12,156.12 90 top
C15  59.61,156.07 90 top
C16  57.04,156.07 90 top
C17  54.5,156.05 90 top
C18  51.89,156.05 90 top
C19  47.2,155.95 90 top
C29  93.7,151.04 270 top
C30  97.86,119.46 0 top
C31  93.04,123.04 90 top
C33  100,144.04 180 top
D2  3,12 90 bottom
D3  21,12 90 bottom
D4  39,12 90 bottom
D5  57,12 90 bottom
D6  3,30 90 bottom
D7  21,30 90 bottom
D8  39,30 90 bottom
D9  57,30 90 bottom
D10  75,30 90 bottom
D11  93,30 90 bottom
D12  3,102 90 bottom
D13  21,102 90 bottom
D14  39,102 90 bottom
D15  57,102 90 bottom
D16  3,84 90 bottom
D17  21,84 90 bottom
D18  39,84 90 bottom
D19  57,84 90 bottom
D20  75,12 90 bottom
D21  93,12 90 bottom
D22  3,66 90 bottom
D23  21,66 90 bottom
D24  39,66 90 bottom
D25  57,66 90 bottom
D26  3,48 90 bottom
D27  21,48 90 bottom
D28  39,48 90 bottom
D29  57,48 90 bottom
D34  75,102 90 bottom
D35  93,102 90 bottom
D36  75,84 90 bottom
D37  93,84 90 bottom
D38  75,66 90 bottom
D39  93,66 90 bottom
D40  75,48 90 bottom
D41  93,48 90 bottom
F0_LED  77,148 0 top
F1_LED  77,138 0 top
F2_LED  77,128 0 top
F3_LED  77,118 0 top
JP1  110.9,158.4 0 bottom
JP2  97.2,159.7 0 top
JP3  113,145.9 180 top
L1  108.96,139.99 180 top
POWER_LED  107.1,151.5 0 top
Q2  24,110.3 90 top
Q4  98.13,123.17 180 top
R1  15,157 180 top
R2  37,156 90 top
R3  80.4,143.4 90 top
R4  81,128 180 top
R5  86.59,150.11 270 top
R6  30,157 180 top
R8  107.41,146.47 90 top
R9  82,138 180 top
R10  82,118 180 top
R12  29,110 180 top
R13  8,110 180 top
R14  13,110 0 top
R15  18,110 0 top
R29  93.04,128.29 90 top
R30  90.16,149.69 270 top
S1  11,100 90 top
S2  29,100 90 top
S3  47,100 90 top
S4  65,100 90 top
S5  11,82 90 top
S6  29,82 90 top
S7  47,82 90 top
S8  65,82 90 top
S9  11,64 90 top
S10  29,64 90 top
S11  47,64 90 top
S12  65,64 90 top
S13  11,46 90 top
S14  29,46 90 top
S15  47,46 90 top
S16  65,46 90 top
S17  11,28 90 top
S18  29,28 90 top
S19  47,28 90 top
S20  65,28 90 top
S21  11,10 90 top
S22  29,10 90 top
S23  47,10 90 top
S24  65,10 90 top
S25  83,28 90 top
S26  101,28 90 top
S27  83,10 90 top
S28  101,10 90 top
S33  83,100 90 top
S34  101,100 90 top
S35  83,82 90 top
S36  101,82 90 top
S37  83,64 90 top
S38  101,64 90 top
S39  83,46 90 top
S40  101,46 90 top
U$1  99.77,151.46 0 top
U$4  4.97,113.35 0 top
U$11  104.15,128.08 315 top
U$16  79.66,159.74 180 top
W0_LED1  9,157 0 top
W1_LED1  26,157 0 top
W2_LED1  43,157 180 top

### Tracks (layer width: path | path; a pad name or v marks a point on that pad's centre or on a via)
+3V3  (via drill 0.6)  (2 unrouted)
  Top 0.406: U$4.43 U$4.42 U$4.41 | U$4.33 U$4.34 U$4.35 U$4.36 U$4.37 | U$11.14 97.77,125.1 95.6,125.1 94.79,125.71 C2.2 94.61,126.99 94.3,127.3 93.17,127.3 R29.1 91.97,127.44 v91.2,128.2 | U$11.34 111.55,129.83 C9.2 113.31,129.29 v114.1,128.5 | v110.9,136.5 109.81,137.59 L1.1 109.81,141.21 v114.7,141 | U$4.30 U$4.31 | 100.2,155 v103.1,155 | v100.5,141.8 99.77,142.53
  Top 0.61: Q2.E 25,111.05 25,128 18.95,134.06 U$4.41 | W1_LED1.A 24.73,158.73 26,160 | W0_LED1.A 7.73,159.73 8,160 26,160 | U$4.30 46.88,154.14 C19.+ 46.74,154 45.4,154 44.27,155.13 W2_LED1.A 44.27,158.27 42.54,160 26,160
  Bottom 0.406: JP1.2 114.83,159.67 115.4,159.1 115.4,141.7 v114.7,141 | v103.1,155 105.83,152.27 POWER_LED.A
  Bottom 0.61: U$4.41 18.95,152.94 20,154 24,154 24.73,154.73 24.73,155 | 24,156.73 W1_LED1.A 24.73,155 | 24.73,155 25.73,154 28,154 29,153 29,151.55 U$4.37 | v114.1,128.5 114.1,133.3 v110.9,136.5 110.4,137 105.2,137 104.8,137.4 104.8,141 104,141.8 102.1,141.8 v100.5,141.8 96,141.8 94.3,140.1 94.3,135.5 91.3,132.5 91.2,132.5 v91.2,128.2 91.2,124 88.8,121.6 77.43,121.6 75.73,123.3
  Bottom 0.813: 76,117.73 F3_LED.A 75.73,123.3 F2_LED.A F1_LED.A F0_LED.A 47,148 44.34,150.66 U$4.31
AVCC  (via drill 0.6)
  Top 0.406: U$11.24 107.62,120.08 C12.2 107.62,118.48 108.9,117.2 v109.7,117.2 | U$11.42 105.57,132.9 104.8,132.9 104.3,133.4 104.3,133.89 U$11.44 105.89,135.48 C10.2 106,137.12 v106,138.6 107.39,139.99 L1.2
  Bottom 0.61: v109.7,117.2 115.3,122.8 115.3,134.1 110.8,138.6 v106,138.6
DISPLAY_PWM  (via drill 0.6)
  Top 0.406: R12.1 34,110 42,118 43.5,118 v63,118 | U$11.32 111.35,125.4 v113.2,125.4
  Bottom 0.406: v113.2,125.4 109,125.4 97.1,113.5 70.5,113.5 66,118 v63,118
F0_LED  (via drill 0.6)
  Top 0.406: U$11.36 108.6,129.14 v108.6,127.6 | v98.2,116.2 95.8,116.2 88,124 88,127.2 85.2,130 85.2,137.7 83.05,139.85 82.9,140 80.4,142.5 R3.1
  Bottom 0.406: v98.2,116.2 98.2,117.2 v108.6,127.6
F1_LED  (via drill 0.6)
  Top 0.406: U$11.37 107,128.67 v107,127.8 | R9.1 83.6,138 84.4,137.2 84.4,129.7 87,127.1 87,123.1 v95.4,114.7
  Bottom 0.406: v95.4,114.7 95.4,116.2 v107,127.8
F2_LED  (via drill 0.6)
  Top 0.406: R4.1 85,128 86,127 86,122.4 v93.7,114.7 | U$11.38 v105.6,128.4
  Bottom 0.406: v93.7,114.7 93.7,116.5 v105.6,128.4
F3_LED  (via drill 0.6)
  Top 0.406: U$11.39 106.17,130.1 v105.4,130.1 | v91,114.8 87.8,118 R10.1
  Bottom 0.406: v91,114.8 91,115.7 v105.4,130.1
GND  (via drill 0.6)
  Top 0.406: C30.1 94.74,119.46 93.1,121.1 93.1,122.11 C31.1 92.97,122.1 91.7,122.1 91,122.8 91,125 90.4,125.6 v90,125.6 91.3,125.6 | U$11.23 105.92,120.65 C12.1 105.92,118.58 109.4,115.1 v109.6,115.1 | U$11.15 98.31,124.5 94.6,124.5 94.3,124.8 92.1,124.8 91.3,125.6 | C2.1 92.8,125.6 91.3,125.6 | U$11.35 112.12,131.53 C9.1 | C9.1 116.03,131.53 v116.4,131.9 | U$11.43 107.59,136.05 C10.1 107.82,137.01 C9.1 | v99.1,137.4 99.1,135.67 C1.2 98.99,134.37 U$11.5 | v103.7,140.4 105.56,142.26 v105.79,142.26 | U$16.GND 76.96,156.94 76.56,156.54 | C29.- 92.1,151.14 v92.1,153.1
  Top 0.61: U$4.20 U$4.21 U$4.22 66.01,112 v68,112 | 49.55,157.55 49,157 49,151.87 U$4.29 49.42,149.43 49,149 42,149 41.8,149.19 U$4.32 | 49.55,157.55 C18.- C17.- 54.53,157.57 C16.- C15.- 59.66,157.62 C14.- 62.25,157.5 C13.- 71,157.5 72.7,155.8 | C19.- 47.29,157.55 49.55,157.55 | 75.66,157.04 U$16.SHIELD3 76.56,156.54 | 75.66,157.04 U$16.SHIELD4 75.41,159.6 v72.6,159.6 | U$16.SHIELD2 83.66,157.94 U$16.SHIELD1 83.8,159.6 v86.2,159.6 | v93.6,143.2 94.44,144.04 C33.- 97.45,144.64 U$1.1 94.87,148.36 C29.- | v83.1,145.4 72.7,155.8 | 75.66,157.04 73.94,157.04 72.7,155.8 | R8.1 107.41,143.87 v105.79,142.26
  Bottom 0.406: v99.1,137.4 99.1,138 101.5,140.4 v103.7,140.4 | JP1.6 106.49,157.8 102.1,157.8 101.5,157.2 95.1,157.2 92.1,154.2 v92.1,153.1
  Bottom 0.61: v68,112 70.6,109.4 101.5,109.4 106.9,114.8 109.3,114.8 v109.6,115.1 116.4,121.9 v116.4,131.9 116.4,137 110.1,143.3 | v90,125.6 90,132.6 93.3,135.9 93.3,141.4 95.2,143.3 | 106.84,143.3 95.2,143.3 | 95.2,143.3 93.7,143.3 v93.6,143.2 85.3,143.2 v83.1,145.4 | JP3.2 111.67,143.3 110.1,143.3 | 106.84,143.3 v105.79,142.26 | 110.1,143.3 106.84,143.3 | v72.6,159.6 v86.2,159.6
KEY_0  (via drill 0.6)
  Top 0.406: U$11.18 101.5,124.3 103.3,124.3 104.2,123.4 104.2,119 109.3,113.9 v110.4,113.9 | v112.1,107.4 111.1,106.7 v106.4,106.7
  Bottom 0.406: D12.C D13.C D14.C D15.C D34.C D35.C 104.6,100.3 106.4,102.1 v106.4,106.7 | v110.4,113.9 110.4,112.4 112.1,110.7 v112.1,107.4
KEY_1  (via drill 0.6)
  Top 0.406: U$11.19 99.9,121.57 99.9,116.1 v105,111
  Bottom 0.406: D16.C D17.C D18.C D19.C D36.C D37.C 106.3,82.3 109,85 109,107 v105,111
KEY_2  (via drill 0.6)
  Top 0.406: U$11.20 100.7,121.24 100.7,117.8 v107.5,111
  Bottom 0.406: D22.C D23.C D24.C D25.C D38.C D39.C 93.3,64 109,64 110,65 110,108.5 v107.5,111
KEY_3  (via drill 0.6)
  Top 0.406: U$11.21 101.6,121.01 101.6,119.3 v109.9,111
  Bottom 0.406: D26.C D27.C D28.C D29.C D40.C D41.C 93.3,46 109,46 111,48 111,109.9 v109.9,111
KEY_4  (via drill 0.6)
  Top 0.406: U$11.25 112,116.83 v112,115.3
  Bottom 0.406: D6.C D7.C D8.C D9.C D10.C D11.C 109.3,28.3 112,31 112,104.8 113.3,106.1 113.3,111.4 112,112.7 v112,115.3
KEY_5  (via drill 0.6)
  Top 0.406: U$11.22 102.88,119.12 109.7,112.3 112.2,112.3 v113.2,113.3
  Bottom 0.406: D2.C D3.C D4.C D5.C D20.C D21.C 109.3,10.3 113,14 113,104.2 114.4,105.6 114.4,112.1 v113.2,113.3
KEY_GROUP_0  (via drill 0.6)
  Top 0.406: v13.49,107.49 S1.4 S1.3 S5.4 S5.3 S9.4 S9.3 S13.4 S13.3 S17.4 S17.3 S21.4 S21.3 | U$11.28 110.13,122.1 v111.3,122.1 | v74.2,111.9 74.2,114.8 v74,115 | v33,112 42,121 v65,121
  Bottom 0.406: v13.49,107.49 15,109 30,109 v33,112 | v111.3,122.1 103.1,113.9 100.1,113.9 99.2,113 99.2,111.2 98.9,110.9 75.2,110.9 v74.2,111.9 | v74,115 74,118 71,121 v65,121
KEY_GROUP_1  (via drill 0.6)
  Top 0.406: S6.4 S6.3 S10.4 S10.3 S14.4 S14.3 S18.4 S18.3 S22.4 S22.3 | S2.4 S2.3 S6.4 | S6.4 36,93.76 36,109 43,116 78.2,116 81.7,112.5 v83.7,112.5 | U$11.29 109.86,123.5 v110.8,123.4
  Bottom 0.406: v110.8,123.4 102.1,115.3 100.4,115.3 97.6,112.5 v83.7,112.5
KEY_GROUP_2  (via drill 0.6)
  Top 0.406: S23.3 S23.4 S19.3 S19.4 S15.3 S15.4 S11.3 S11.4 S7.3 S7.4 S3.3 S3.4 49.49,107.49 51,109 84.1,109 86.5,111.4 v100.6,111.4 | U$11.30 109.99,124.5 111.9,124.5 111.9,124.4 v112.8,123.5
  Bottom 0.406: v100.6,111.4 102.3,113.1 103.8,113.1 112.8,122.1 v112.8,123.5
KEY_GROUP_3  (via drill 0.6)
  Top 0.406: S4.4 S4.3 S8.4 S8.3 S12.4 S12.3 S16.4 S16.3 S20.4 S20.3 S24.4 S24.3 | v95,129.6 96.29,128.01 U$11.12 | v67.6,110.4 84,110.4 v88.6,115
  Bottom 0.406: S4.4 67.49,110.29 v67.6,110.4 | v88.6,115 95,121.4 v95,129.6
KEY_GROUP_4
  Top 0.406: U$11.26 110.47,119.5 112.7,119.5 114.5,117.7 114.5,112.7 111.8,110 96.9,110 95.9,109 86,109 85.49,108.49 S33.4 S33.3 S35.4 S35.3 S37.4 S37.3 S39.4 S39.3 S25.4 S25.3 S27.4 S27.3
KEY_GROUP_5
  Top 0.406: S28.3 S28.4 S26.3 S26.4 S40.3 S40.4 S38.3 S38.4 S36.3 S36.4 S34.3 S34.4 103.49,107.49 104.8,108.8 112.3,108.8 115.4,111.9 115.4,118.3 113.3,120.4 110.7,120.4 U$11.27
MISO  (via drill 0.6)
  Top 0.406: U$4.38 26.57,141.31 30.3,137.57 68.43,137.57 71.6,134.4 v82.6,134.4 | U$11.11 94.67,131.9 88.5,131.9 v88.1,131.5 | v87.6,138.6 87.6,144 v87,144.6
  Bottom 0.406: v82.6,134.4 87.3,134.4 88.1,133.6 | 88.1,133.6 v88.1,131.5 | v87.6,138.6 88.1,138.1 88.1,133.6 | v87,144.6 87.1,144.7 106.2,144.7 113.44,151.94 JP1.1
MOSI  (via drill 0.6)
  Top 0.406: U$4.39 24.02,140.95 29.16,135.82 67.45,135.82 70.57,132.7 v81.4,132.7 | v86.8,132.7 95,132.7 U$11.10 98.8,128.9 100.9,128.9 v104.1,132.1 | v103.9,136.1 103.9,138.1 108.3,142.5 114.7,142.5 115.6,143.4 115.6,160.3 114.5,161.4 111.7,161.4 110.9,160.6 JP1.4
  Bottom 0.406: v86.8,132.7 v81.4,132.7 | v104.1,132.1 104.1,135.9 v103.9,136.1
N$1
  Top 0.406: C30.2 99.1,119.83 99.1,123.03 | 99.1,123.03 99.68,123.62 U$11.17 | Q4.1 98.94,122.87 99.1,123.03
N$2
  Top 0.406: U$11.4 100.4,134.09 100.4,137.8 99.6,138.6 97.7,138.6 95.6,136.5 91,136.5 89.2,138.4 89.2,147.3 87.29,149.21 R5.2
N$3
  Top 0.406: C1.1 97.29,134.94 U$11.6
N$4
  Top 0.406: S25.1 S25.2
  Bottom 0.406: D10.A 75,33 76.25,34.25 S25.2
N$5
  Top 0.406: R8.2 107.41,148.41 108.4,149.4 108.4,151.47 POWER_LED.K
N$6
  Top 0.406: S26.1 S26.2
  Bottom 0.406: D11.A 93,33 94.25,34.25 S26.2
N$7
  Top 0.406: S27.1 S27.2
  Bottom 0.406: D20.A 75,15 76.25,16.25 S27.2
N$8
  Top 0.406: S22.1 S22.2
  Bottom 0.406: D3.A 21,15 22.25,16.25 S22.2
N$9  (1 unrouted)
  Top 0.61: C29.+ 93.7,153.7 94.4,154.4 99.61,154.4 arc90 U$1.4
  Top 0.813: U$1.4 U$1.2
N$10
  Top 0.406: S21.2 S21.1
  Bottom 0.406: D2.A 3,15 4.25,16.25 S21.2
N$11
  Top 0.406: S28.1 S28.2
  Bottom 0.406: D21.A 93,15 94.25,16.25 S28.2
N$12
  Top 0.406: W0_LED1.K R1.2
N$13
  Top 0.406: W1_LED1.K R6.2
N$14
  Top 0.406: R2.2 37.15,157 W2_LED1.K
N$16
  Top 0.406: S33.1 S33.2
  Bottom 0.406: D34.A 75,105 76.25,106.25 S33.2
N$17
  Top 0.406: S34.1 S34.2
  Bottom 0.406: D35.A 93,105 94.25,106.25 S34.2
N$18
  Top 0.406: S23.1 S23.2
  Bottom 0.406: D4.A 39,15 40.25,16.25 S23.2
N$19
  Top 0.406: S35.1 S35.2
  Bottom 0.406: D36.A 75,87 76.25,88.25 S35.2
N$20
  Top 0.406: U$11.3 101.1,134.52 101.1,138.2 100,139.3 97.3,139.3 95.2,137.2 91.3,137.2 89.9,138.6 89.9,148.58 R30.2
N$21
  Top 0.406: S36.1 S36.2
  Bottom 0.406: D37.A 93,87 94.25,88.25 S36.2
N$22
  Top 0.406: S24.1 S24.2
  Bottom 0.406: D5.A 57,15 58.25,16.25 S24.2
N$23
  Top 0.406: F0_LED.K 78.27,146.38 R3.2
N$25
  Top 0.406: F1_LED.K R9.2
N$26
  Top 0.406: F2_LED.K R4.2
N$27
  Top 0.406: S37.1 S37.2
  Bottom 0.406: D38.A 75,69 76.25,70.25 S37.2
N$28
  Top 0.406: S38.1 S38.2
  Bottom 0.406: D39.A 93,69 94.25,70.25 S38.2
N$29
  Top 0.406: C31.2 94,123.92 | 94,123.92 98.86,123.92 U$11.16 | Q4.3 94.73,120.97 94,121.7 94,123.92
N$30
  Top 0.406: F3_LED.K R10.2
N$31
  Top 0.406: Q2.B 25.75,110 R12.2
N$32
  Top 0.61: U$4.3 16.41,110.75 R15.1
N$33
  Top 0.61: R14.1 12.2,110.05 12.2,110.9 13.87,112.56 U$4.2
N$34
  Top 0.61: U$4.23 64.67,153.66 65,154 C13.+
N$35
  Top 0.61: U$4.1 10.5,113.35 8.85,111.7 R13.1
N$36
  Top 0.61: U$4.24 C14.+
N$37
  Top 0.61: R14.2 14,110 16,108 20.85,108 | R13.2 7.15,114.15 10,117 20,117 22.9,114.1 Q2.C 22.9,108.9 22,108 20.85,108 | 20.85,108 R15.2
N$38
  Top 0.61: C15.+ 59.59,153.57 U$4.25
N$39
  Top 0.406: S39.1 S39.2
  Bottom 0.61: D40.A 75,51 76.25,52.25 S39.2
N$40
  Top 0.61: U$4.26 C16.+
N$41
  Top 0.406: S40.1 S40.2
  Bottom 0.406: D41.A 93,51 94,52 99,52 98.75,52.25 S40.2
N$45
  Top 0.61: U$4.27 C17.+
N$58
  Top 0.61: U$4.28 51.89,150.45 C18.+
N$70
  Top 0.406: S18.1 S18.2
  Bottom 0.406: D7.A 21,33 22.25,34.25 S18.2
N$71
  Top 0.406: S17.1 S17.2
  Bottom 0.406: D6.A 3,33 4.25,34.25 S17.2
N$72
  Top 0.406: S19.1 S19.2
  Bottom 0.406: D8.A 39,33 40.25,34.25 S19.2
N$73
  Top 0.406: S20.1 S20.2
  Bottom 0.406: D9.A 57,33 58.25,34.25 S20.2
N$76
  Top 0.406: S3.1 S3.2
  Bottom 0.406: D14.A 39,105 40.25,106.25 S3.2
N$77
  Top 0.406: S4.1 S4.2
  Bottom 0.406: D15.A 57,105 58.25,106.25 S4.2
N$78
  Top 0.406: S2.1 S2.2
  Bottom 0.406: D13.A 21,105 22.25,106.25 S2.2
N$80
  Top 0.406: S1.1 S1.2
  Bottom 0.406: D12.A 3,105 4.25,106.25 S1.2
N$81
  Top 0.406: S8.1 S8.2
  Bottom 0.406: D19.A 57,87 58.25,88.25 S8.2
N$83
  Top 0.406: S6.1 S6.2
  Bottom 0.406: D17.A 21,87 22.25,88.25 S6.2
N$84
  Top 0.406: S5.1 S5.2
  Bottom 0.406: D16.A 3,87 4.25,88.25 S5.2
N$87
  Top 0.406: S7.1 S7.2
  Bottom 0.406: D18.A 39,87 40.25,88.25 S7.2
N$93
  Top 0.406: S11.1 S11.2
  Bottom 0.406: D24.A 39,69 40.25,70.25 S11.2
N$95
  Top 0.406: S12.1 S12.2
  Bottom 0.406: D25.A 57,69 58.25,70.25 S12.2
N$96
  Top 0.406: S10.1 S10.2
  Bottom 0.406: D23.A 21,69 22.25,70.25 S10.2
N$97
  Top 0.406: S9.1 S9.2
  Bottom 0.406: D22.A 3,69 4.25,70.25 S9.2
N$99
  Top 0.406: S16.1 S16.2
  Bottom 0.406: D29.A 57,51 58.25,52.25 S16.2
N$101
  Top 0.406: S15.1 S15.2
  Bottom 0.406: D28.A 39,51 40.25,52.25 S15.2
N$102
  Top 0.406: S14.1 S14.2
  Bottom 0.406: D27.A 21,51 22.25,52.25 S14.2
N$104
  Top 0.406: S13.1 S13.2
  Bottom 0.406: D26.A 3,51 4.25,52.25 S13.2
RESET  (via drill 0.6)
  Top 0.406: U$11.13 97.24,125.7 96.2,125.7 95.6,126.3 95.6,127.5 93.97,129.13 R29.2 93,129.17 v93,130.7 | v95.6,139.1 94.4,137.9 91.7,137.9 90.6,138.8 90.6,144 v93.7,147.2
  Bottom 0.406: v93,130.7 93,132.8 95.6,135.4 v95.6,139.1 | v93.7,147.2 103.63,157.13 JP1.5
SCL  (via drill 0.6)
  Top 0.406: U$4.40 21.48,139.51 28,133 68,133 70.1,130.9 v79.5,130.9 | U$11.9 94.83,134 88.1,134 v86.5,135.6 | v85.8,139.6 85.8,141.9 84.4,143.3 v84.4,146.9
  Bottom 0.406: v79.5,130.9 79.4,131 79.4,133.1 82.2,135.9 86.2,135.9 | v85.8,139.6 86.2,139.2 86.2,135.9 | 86.2,135.9 v86.5,135.6 | v84.4,146.9 85.5,145.8 105.9,145.8 110.9,150.8 JP1.3
USB_DM
  Top 0.406: U$16.D- 80.31,154.59 81.3,153.6 88.2,153.6 90.2,151.6 90.2,150.58 R30.1
USB_DP
  Top 0.406: R5.1 86.6,152.07 86.6,152.3 86,152.9 80.8,152.9 79.66,154.04 U$16.D+
USB_VBUS  (via drill 0.6)
  Top 0.406: U$11.7 95.5,135.6 90.6,135.6 88.6,138 88.5,146.4 84,149.6 v83.1,149.6 | U$16.VBUS 80.96,155.84 81.8,155 v82.2,155 89.96,155 JP2.1
  Bottom 0.406: v82.2,155 83.1,154 v83.1,149.6
V_BAT  (1 unrouted)
  Top 0.406: 97.3,159.6 97.3,156.8 97.5,156.6 103.7,156.6 104.3,156 104.3,148.8 103.86,148.36 U$1.3
  Top 0.61: 104.3,159.7 105.6,158.4 105.6,155.6 107.2,154 110.6,154 113,151.6 JP3.1 | C33.+ 102.1,145.08 102.1,148.9 102.08,148.88 U$1.3
W0_LED  (via drill 0.6)
  Top 0.406: R1.1 21,157 v22,158 | U$11.1 102.9,135.01 102.9,139.6 101.8,140.7 97.4,140.7 96.8,141.3 v91.8,141.3
  Bottom 0.406: v22,158 24,160 63,160 68.3,154.7 76.7,154.7 81.7,149.7 81.7,143.2 82.7,142.2 89.6,142.2 90.5,141.3 v91.8,141.3
W1_LED  (via drill 0.6)
  Top 0.406: R6.1 31.85,158 v32,158 | U$11.33 111.08,126.88 112.38,126.88 v113,127.5 | v101.8,139 100.8,140 96.5,140 96,140.5 93.7,140.5 93.3,140.5 v92,139.2
  Bottom 0.406: v32,158 33,159 62.2,159 67.5,153.7 76.6,153.7 80.7,149.6 80.7,142.7 82,141.4 87.8,141.4 90,139.2 v92,139.2 | 110.9,127.4 112.9,127.4 v113,127.5 | 110.9,127.4 110.8,127.4 | v101.8,139 101.8,131.3 103.1,130 103.6,130 105.4,131.8 106.5,131.8 110.9,127.4
W2_LED  (via drill 0.6)
  Top 0.406: R2.1 37.15,155 v40,155 | U$11.8 95.17,134.8 89.1,134.8 84.4,139.5 v84.4,140.3
  Bottom 0.406: v84.4,140.3 81,140.3 79.8,141.5 79.8,149.4 76.6,152.6 67,152.6 64.6,155 v40,155

### Text on the board
Top: DigitalCalculator V1.0 (C) 2020 HS Karlsruhe